# EAGLE schematic eclaire XL new (EAGLE 7.2.0)

## Sheet 1 of 16: FPGACore
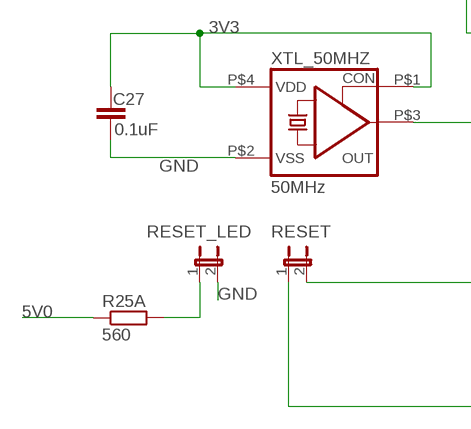
[diagram p0: schematic, sheet 1, part 1 of 2]
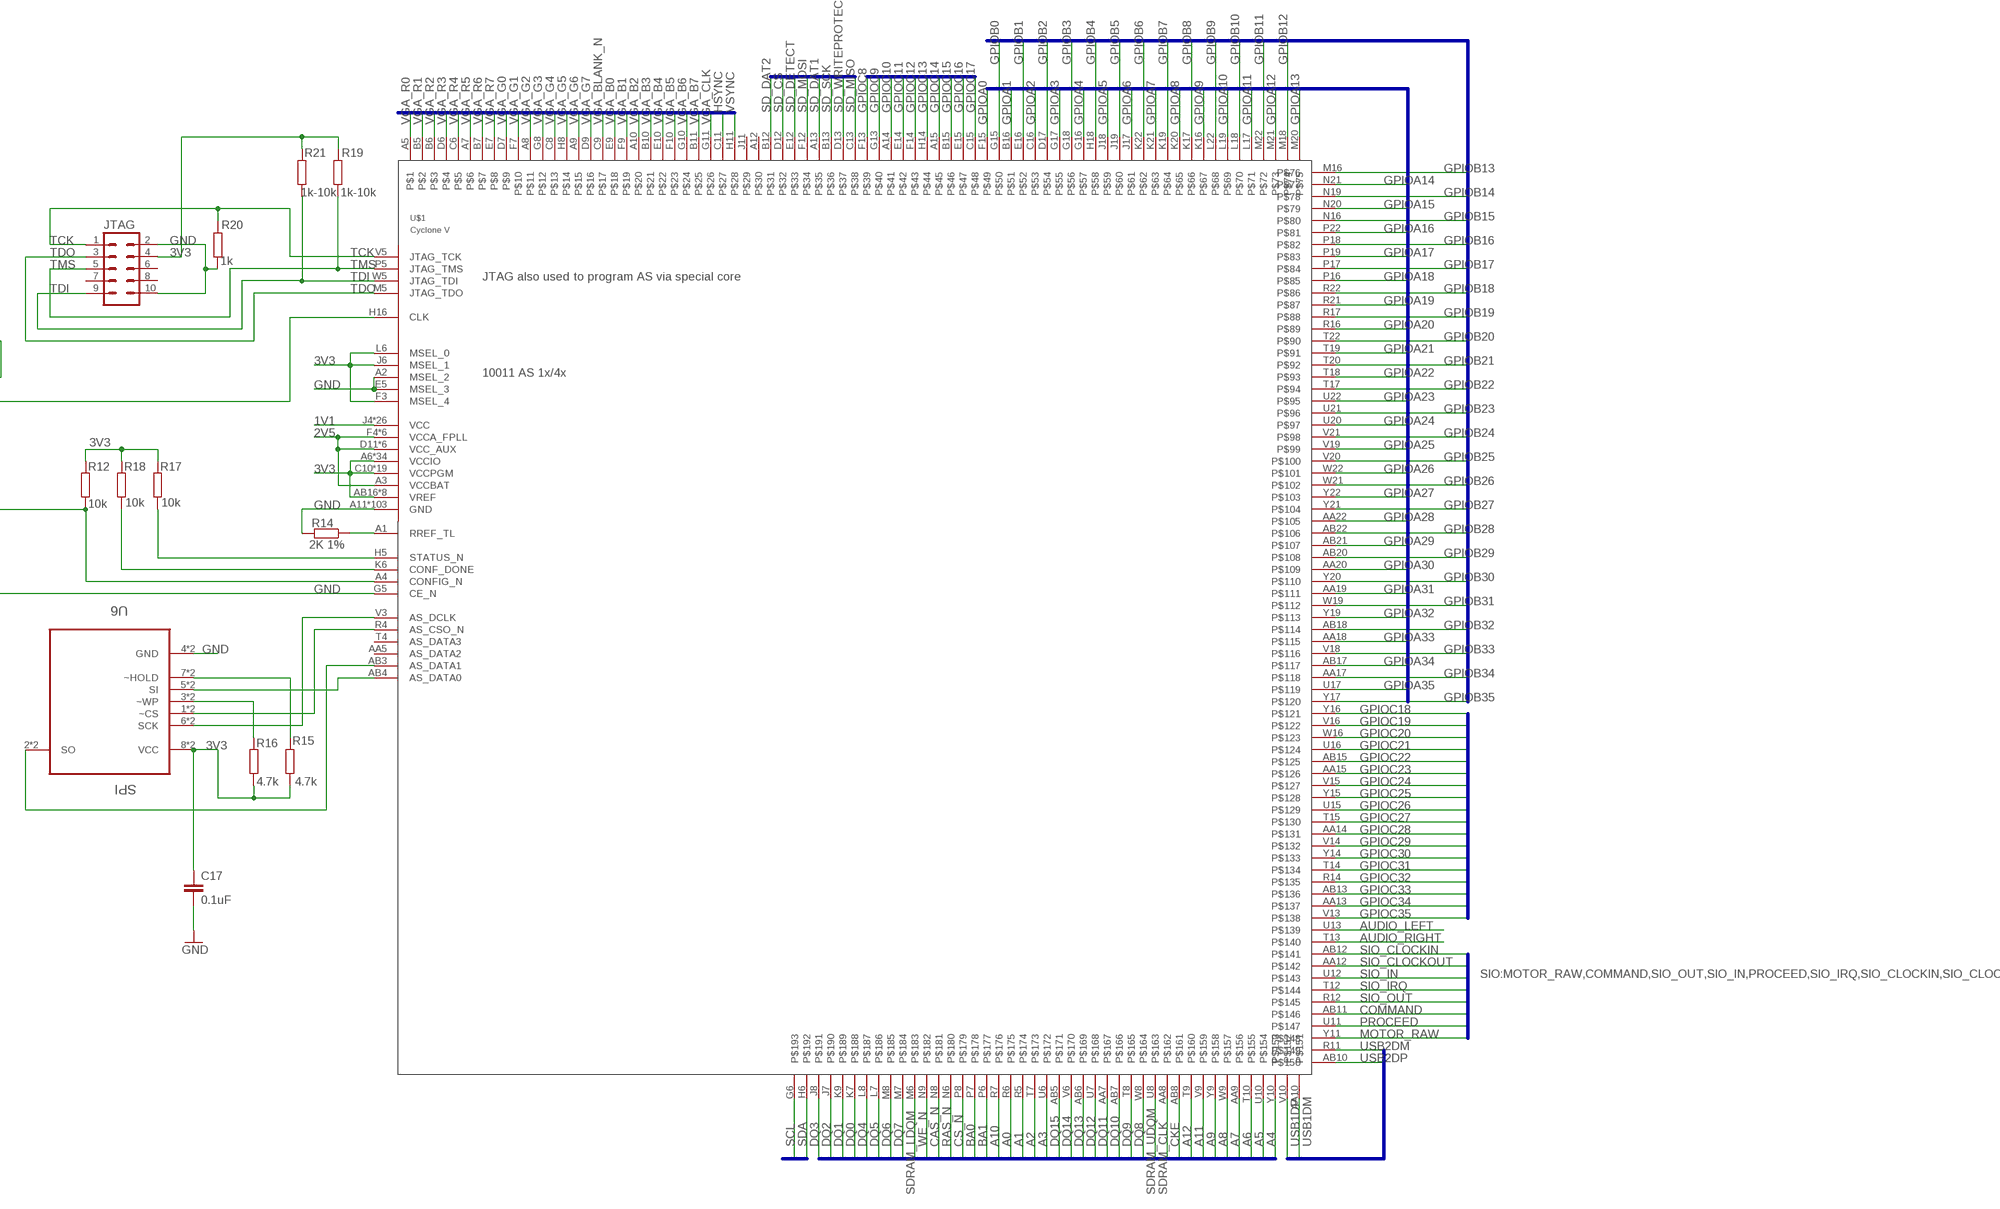
[diagram p1: schematic, sheet 1, part 2 of 2]

### Parts
C17  0.1uF  C-EUC0805  [C0805]
C27  0.1uF  C-EUC0805  [C0805]
JTAG  ML10  [ML10]
R12  10k  R-EU_M0805  [M0805]
R14  2K 1%  R-EU_M0805  [M0805]
R15  4.7k  R-EU_M0805  [M0805]
R16  4.7k  R-EU_M0805  [M0805]
R17  10k  R-EU_M0805  [M0805]
R18  10k  R-EU_M0805  [M0805]
R19  1k-10k  R-EU_M0805  [M0805]
R20  1k  R-EU_M0805  [M0805]
R21  1k-10k  R-EU_M0805  [M0805]
R25A  560  R-EU_M0805  [M0805]
RESET  RESET  JP1E  [JP1]
RESET_LED  RESET  JP1E  [JP1]
SPI  U6  EPCSBOTH  [EPCS_BOTH]
U$1  U7  CYCLONEVFPGA484SMALLPINS  [CYCLONEVF484V2]
XTL_50MHZ  50MHz  CRYSTAL_RES-SG636  [SG-636]

### Nets
1V1: U$1.J4(VCC) U$1.J10(VCC) U$1.J12(VCC) U$1.J14(VCC) U$1.J16(VCC) U$1.K3(VCC) U$1.K5(VCC) U$1.K11(VCC) U$1.K13(VCC) U$1.K15(VCC) U$1.L4(VCC) U$1.L10(VCC) U$1.L12(VCC) U$1.L14(VCC) U$1.L16(VCC) U$1.M11(VCC) U$1.M13(VCC) U$1.M15(VCC) U$1.N4(VCC) U$1.N10(VCC) U$1.N12(VCC) U$1.N14(VCC) U$1.P3(VCC) U$1.P11(VCC) U$1.P13(VCC) U$1.P15(VCC) ; also sheet 2,9
2V5: U$1.A3(VCCBAT) U$1.D11(VCC_AUX) U$1.D18(VCC_AUX) U$1.E6(VCC_AUX) U$1.F4(VCCA_FPLL) U$1.H19(VCCA_FPLL) U$1.M3(VCCA_FPLL) U$1.T3(VCCA_FPLL) U$1.T5(VCCA_FPLL) U$1.U18(VCCA_FPLL) U$1.W7(VCC_AUX) U$1.W13(VCC_AUX) U$1.W18(VCC_AUX) ; also sheet 2,9
3V3: C17.1 C27.1 JTAG.4 R12.2 R15.1 R16.1 R17.2 R18.2 R19.2 R21.2 SPI.8(VCC) SPI.L$2(VCC) U$1.A6(VCCIO) U$1.A16(VCCIO) U$1.AA16(VCCIO) U$1.AA21(VCCIO) U$1.AB16(VREF) U$1.B8(VREF) U$1.B19(VCCIO) U$1.C7(VCCIO) U$1.C10(VCCPGM) U$1.C12(VCCIO) U$1.C14(VREF) U$1.C22(VCCIO) U$1.D4(VCCIO) U$1.D8(VCCPGM) U$1.D14(VCCPGM) U$1.D15(VCCIO) U$1.D16(VCCPGM) U$1.E1(VCCPGM) U$1.E8(VCCIO) U$1.E11(VCCPGM) U$1.E18(VCCIO) U$1.F3(MSEL_4) U$1.F8(VCCPGM) U$1.F11(VCCIO) U$1.F21(VCCIO) U$1.G7(VCCIO) U$1.G14(VCCIO) U$1.H17(VCCIO) U$1.J1(VCCIO) U$1.J2(VCCPGM) U$1.J6(MSEL_1) U$1.K18(VCCIO) U$1.L6(MSEL_0) U$1.L20(VREF) U$1.M17(VCCPGM) U$1.M19(VCCIO) U$1.N18(VCCPGM) U$1.P20(VCCIO) U$1.P21(VCCPGM) U$1.R1(VCCIO) U$1.R2(VCCPGM) U$1.R8(VCCIO) U$1.R18(VCCIO) U$1.R19(VCCPGM) U$1.R20(VREF) U$1.T6(VCCIO) U$1.T11(VCCIO) U$1.U14(VCCIO) U$1.U19(VCCIO) U$1.V8(VCCPGM) U$1.W1(VREF) U$1.W6(VCCPGM) U$1.W10(VCCIO) U$1.W11(VCCPGM) U$1.W12(VCCPGM) U$1.W14(VCCPGM) U$1.W15(VCCIO) U$1.W17(VCCPGM) U$1.W20(VCCIO) U$1.Y4(VCCIO) U$1.Y7(VREF) U$1.Y8(VCCIO) U$1.Y12(VREF) U$1.Y13(VCCIO) XTL_50MHZ.P$1(CON) XTL_50MHZ.P$4(VDD) ; also sheet 2,3,5,6,8,9,10,11,15,16
5V0: R25A.1 ; also sheet 3,5,7,9,13,14,15
A0: U$1.R6 ; also sheet 6
A1: U$1.R5 ; also sheet 6
A2: U$1.T7 ; also sheet 6
A3: U$1.U6 ; also sheet 6
A4: U$1.Y10 ; also sheet 6
A5: U$1.U10 ; also sheet 6
A6: U$1.T10 ; also sheet 6
A7: U$1.AA9 ; also sheet 6
A8: U$1.W9 ; also sheet 6
A9: U$1.Y9 ; also sheet 6
A10: U$1.R7 ; also sheet 6
A11: U$1.V9 ; also sheet 6
A12: U$1.T9 ; also sheet 6
AUDIO_LEFT: U$1.U13 ; also sheet 4
AUDIO_RIGHT: U$1.T13 ; also sheet 4
BA0: U$1.P7 ; also sheet 6
BA1: U$1.P6 ; also sheet 6
CAS_N: U$1.N8 ; also sheet 6
CKE: U$1.AB8 ; also sheet 6
COMMAND: U$1.AB11 ; also sheet 13
CONF_DONE: R18.1 U$1.K6(CONF_DONE)
CONFIG_N: R12.1 RESET.2 U$1.A4(CONFIG_N)
CS_N: U$1.P8 ; also sheet 6
DQ0: U$1.K7 ; also sheet 6
DQ1: U$1.K9 ; also sheet 6
DQ2: U$1.J7 ; also sheet 6
DQ3: U$1.J8 ; also sheet 6
DQ4: U$1.L8 ; also sheet 6
DQ5: U$1.L7 ; also sheet 6
DQ6: U$1.M8 ; also sheet 6
DQ7: U$1.M7 ; also sheet 6
DQ8: U$1.W8 ; also sheet 6
DQ9: U$1.T8 ; also sheet 6
DQ10: U$1.AB7 ; also sheet 6
DQ11: U$1.AA7 ; also sheet 6
DQ12: U$1.U7 ; also sheet 6
DQ13: U$1.AB6 ; also sheet 6
DQ14: U$1.V6 ; also sheet 6
DQ15: U$1.AB5 ; also sheet 6
GND: C17.2 C27.2 JTAG.2 JTAG.10 R14.2 R20.2 RESET.1 RESET_LED.2 SPI.4(GND) SPI.L$10(GND) U$1.A2(MSEL_2) U$1.A11(GND) U$1.A21(GND) U$1.AA3(GND) U$1.AA4(GND) U$1.AA6(GND) U$1.AA11(GND) U$1.AB1(GND) U$1.AB2(GND) U$1.AB9(GND) U$1.AB14(GND) U$1.AB19(GND) U$1.B1(GND) U$1.B2(GND) U$1.B9(GND) U$1.B14(GND) U$1.C3(GND) U$1.C4(GND) U$1.C5(GND) U$1.C17(GND) U$1.D1(GND) U$1.D2(GND) U$1.D5(GND) U$1.D10(GND) U$1.D20(GND) U$1.E3(GND) U$1.E4(GND) U$1.E5(MSEL_3) U$1.E13(GND) U$1.F1(GND) U$1.F2(GND) U$1.F5(GND) U$1.F6(GND) U$1.F16(GND) U$1.F17(GND) U$1.G3(GND) U$1.G4(GND) U$1.G5(CE_N) U$1.G9(GND) U$1.G19(GND) U$1.H1(GND) U$1.H2(GND) U$1.H3(GND) U$1.H4(GND) U$1.H7(GND) U$1.H12(GND) U$1.H15(GND) U$1.H22(GND) U$1.J3(GND) U$1.J5(GND) U$1.J15(GND) U$1.J20(GND) U$1.K1(GND) U$1.K2(GND) U$1.K4(GND) U$1.K8(GND) U$1.K10(GND) U$1.K12(GND) U$1.K14(GND) U$1.L3(GND) U$1.L5(GND) U$1.L11(GND) U$1.L13(GND) U$1.L15(GND) U$1.L21(GND) U$1.M1(GND) U$1.M2(GND) U$1.M4(GND) U$1.M10(GND) U$1.M12(GND) U$1.M14(GND) U$1.N3(GND) U$1.N5(GND) U$1.N7(GND) U$1.N11(GND) U$1.N13(GND) U$1.N15(GND) U$1.N17(GND) U$1.N22(GND) U$1.P1(GND) U$1.P2(GND) U$1.P4(GND) U$1.P10(GND) U$1.R3(GND) U$1.R13(GND) U$1.T1(GND) U$1.T2(GND) U$1.T16(GND) U$1.T21(GND) U$1.U3(GND) U$1.U4(GND) U$1.U5(GND) U$1.U9(GND) U$1.V1(GND) U$1.V2(GND) U$1.V4(GND) U$1.V7(GND) U$1.V12(GND) U$1.V17(GND) U$1.V22(GND) U$1.W3(GND) U$1.W4(GND) U$1.Y1(GND) U$1.Y2(GND) U$1.Y5(GND) U$1.Y18(GND) XTL_50MHZ.P$2(VSS) ; also sheet 2,3,4,5,6,7,8,9,10,11,12,13,14,15,16
GPIOA0: U$1.F15 ; also sheet 5
GPIOA1: U$1.B16 ; also sheet 5
GPIOA2: U$1.C16 ; also sheet 5
GPIOA3: U$1.G17 ; also sheet 5
GPIOA4: U$1.G16 ; also sheet 5
GPIOA5: U$1.J18 ; also sheet 5
GPIOA6: U$1.J17 ; also sheet 5
GPIOA7: U$1.K21 ; also sheet 5
GPIOA8: U$1.K20 ; also sheet 5
GPIOA9: U$1.K16 ; also sheet 5
GPIOA10: U$1.L19 ; also sheet 5
GPIOA11: U$1.L17 ; also sheet 5
GPIOA12: U$1.M21 ; also sheet 5
GPIOA13: U$1.M20 ; also sheet 5
GPIOA14: U$1.N21 ; also sheet 5
GPIOA15: U$1.N20 ; also sheet 5
GPIOA16: U$1.P22 ; also sheet 5
GPIOA17: U$1.P19 ; also sheet 5
GPIOA18: U$1.P16 ; also sheet 5
GPIOA19: U$1.R21 ; also sheet 5
GPIOA20: U$1.R16 ; also sheet 5
GPIOA21: U$1.T19 ; also sheet 5
GPIOA22: U$1.T18 ; also sheet 5
GPIOA23: U$1.U22 ; also sheet 5
GPIOA24: U$1.U20 ; also sheet 5
GPIOA25: U$1.V19 ; also sheet 5
GPIOA26: U$1.W22 ; also sheet 5
GPIOA27: U$1.Y22 ; also sheet 5
GPIOA28: U$1.AA22 ; also sheet 5
GPIOA29: U$1.AB21 ; also sheet 5
GPIOA30: U$1.AA20 ; also sheet 5
GPIOA31: U$1.AA19 ; also sheet 5
GPIOA32: U$1.Y19 ; also sheet 5
GPIOA33: U$1.AA18 ; also sheet 5
GPIOA34: U$1.AB17 ; also sheet 5
GPIOA35: U$1.U17 ; also sheet 5
GPIOB0: U$1.G15 ; also sheet 15
GPIOB1: U$1.E16 ; also sheet 15
GPIOB2: U$1.D17 ; also sheet 15
GPIOB3: U$1.G18 ; also sheet 15
GPIOB4: U$1.H18 ; also sheet 15
GPIOB5: U$1.J19 ; also sheet 15
GPIOB6: U$1.K22 ; also sheet 15
GPIOB7: U$1.K19 ; also sheet 15
GPIOB8: U$1.K17 ; also sheet 5
GPIOB9: U$1.L22 ; also sheet 5
GPIOB10: U$1.L18 ; also sheet 5
GPIOB11: U$1.M22 ; also sheet 5
GPIOB12: U$1.M18 ; also sheet 5
GPIOB13: U$1.M16 ; also sheet 5
GPIOB14: U$1.N19 ; also sheet 5
GPIOB15: U$1.N16 ; also sheet 5
GPIOB16: U$1.P18 ; also sheet 14
GPIOB17: U$1.P17 ; also sheet 14
GPIOB18: U$1.R22 ; also sheet 14
GPIOB19: U$1.R17 ; also sheet 14
GPIOB20: U$1.T22 ; also sheet 14
GPIOB21: U$1.T20 ; also sheet 14
GPIOB22: U$1.T17 ; also sheet 14
GPIOB23: U$1.U21 ; also sheet 14
GPIOB24: U$1.V21 ; also sheet 14
GPIOB25: U$1.V20 ; also sheet 14
GPIOB26: U$1.W21 ; also sheet 14
GPIOB27: U$1.Y21 ; also sheet 14
GPIOB28: U$1.AB22 ; also sheet 14
GPIOB29: U$1.AB20 ; also sheet 14
GPIOB30: U$1.Y20 ; also sheet 14
GPIOB31: U$1.W19 ; also sheet 14
GPIOB32: U$1.AB18 ; also sheet 14
GPIOB33: U$1.V18 ; also sheet 14
GPIOB34: U$1.AA17 ; also sheet 14
GPIOB35: U$1.Y17 ; also sheet 14
GPIOC8: U$1.F13 ; also sheet 15
GPIOC9: U$1.G13 ; also sheet 15
GPIOC10: U$1.A14 ; also sheet 15
GPIOC11: U$1.E14 ; also sheet 15
GPIOC12: U$1.F14 ; also sheet 15
GPIOC13: U$1.H14 ; also sheet 15
GPIOC14: U$1.A15 ; also sheet 15
GPIOC15: U$1.B15 ; also sheet 15
GPIOC16: U$1.E15 ; also sheet 5
GPIOC17: U$1.C15 ; also sheet 5
GPIOC18: U$1.Y16 ; also sheet 5
GPIOC19: U$1.V16 ; also sheet 5
GPIOC20: U$1.W16 ; also sheet 14
GPIOC21: U$1.U16 ; also sheet 14
GPIOC22: U$1.AB15 ; also sheet 14
GPIOC23: U$1.AA15 ; also sheet 14
GPIOC24: U$1.V15 ; also sheet 14
GPIOC25: U$1.Y15 ; also sheet 14
GPIOC26: U$1.U15 ; also sheet 14
GPIOC27: U$1.T15 ; also sheet 14
GPIOC28: U$1.AA14 ; also sheet 14
GPIOC29: U$1.V14 ; also sheet 14
GPIOC30: U$1.Y14 ; also sheet 14
GPIOC31: U$1.T14 ; also sheet 14
GPIOC32: U$1.R14 ; also sheet 14
GPIOC33: U$1.AB13 ; also sheet 14
GPIOC34: U$1.AA13 ; also sheet 14
GPIOC35: U$1.V13 ; also sheet 14
HSYNC: U$1.C11 ; also sheet 3
MOTOR_RAW: U$1.Y11 ; also sheet 13
N$6: SPI.6(SCK) SPI.L$16(SCK) U$1.V3(AS_DCLK)
N$7: SPI.1(~CS) SPI.L$7(~CS) U$1.R4(AS_CSO_N)
N$8: SPI.2(SO) SPI.L$8(SO) U$1.AB3(AS_DATA1)
N$9: SPI.5(SI) SPI.L$15(SI) U$1.AB4(AS_DATA0)
N$10: R16.2 SPI.3(~WP) SPI.L$9(~WP)
N$11: R15.2 SPI.7(~HOLD) SPI.L$1(~HOLD)
N$12: U$1.H16(CLK) XTL_50MHZ.P$3(OUT)
N$81: R25A.2 RESET_LED.1
PROCEED: U$1.U11 ; also sheet 13
RAS_N: U$1.N6 ; also sheet 6
RREF_TL: R14.1 U$1.A1(RREF_TL)
SCL: U$1.G6 ; also sheet 11
SD_CS: U$1.D12 ; also sheet 10
SD_DAT1: U$1.A13 ; also sheet 10
SD_DAT2: U$1.B12 ; also sheet 10
SD_DETECT: U$1.E12 ; also sheet 10
SD_MISO: U$1.C13 ; also sheet 10
SD_MOSI: U$1.F12 ; also sheet 10
SD_SCK: U$1.B13 ; also sheet 10
SD_WRITEPROTECT: U$1.D13 ; also sheet 10
SDA: U$1.H6 ; also sheet 11
SDRAM_CLK: U$1.AA8 ; also sheet 6
SDRAM_LDQM: U$1.M6 ; also sheet 6
SDRAM_UDQM: U$1.U8 ; also sheet 6
SIO_CLOCKIN: U$1.AB12 ; also sheet 13
SIO_CLOCKOUT: U$1.AA12 ; also sheet 13
SIO_IN: U$1.U12 ; also sheet 13
SIO_IRQ: U$1.T12 ; also sheet 13
SIO_OUT: U$1.R12 ; also sheet 13
STATUS_N: R17.1 U$1.H5(STATUS_N)
TCK: JTAG.1 R20.1 U$1.V5(JTAG_TCK)
TDI: JTAG.9 R21.1 U$1.W5(JTAG_TDI)
TDO: JTAG.3 U$1.M5(JTAG_TDO)
TMS: JTAG.5 R19.1 U$1.P5(JTAG_TMS)
USB1DM: U$1.AA10 ; also sheet 7
USB1DP: U$1.V10 ; also sheet 7
USB2DM: U$1.R11 ; also sheet 7
USB2DP: U$1.AB10 ; also sheet 7
VGA_B0: U$1.E9 ; also sheet 3
VGA_B1: U$1.F9 ; also sheet 3
VGA_B2: U$1.A10 ; also sheet 3
VGA_B3: U$1.B10 ; also sheet 3
VGA_B4: U$1.E10 ; also sheet 3
VGA_B5: U$1.F10 ; also sheet 3
VGA_B6: U$1.G10 ; also sheet 3
VGA_B7: U$1.B11 ; also sheet 3
VGA_BLANK_N: U$1.C9 ; also sheet 3
VGA_CLK: U$1.G11 ; also sheet 3
VGA_G0: U$1.D7 ; also sheet 3
VGA_G1: U$1.F7 ; also sheet 3
VGA_G2: U$1.A8 ; also sheet 3
VGA_G3: U$1.G8 ; also sheet 3
VGA_G4: U$1.C8 ; also sheet 3
VGA_G5: U$1.H8 ; also sheet 3
VGA_G6: U$1.A9 ; also sheet 3
VGA_G7: U$1.D9 ; also sheet 3
VGA_R0: U$1.A5 ; also sheet 3
VGA_R1: U$1.B5 ; also sheet 3
VGA_R2: U$1.B6 ; also sheet 3
VGA_R3: U$1.D6 ; also sheet 3
VGA_R4: U$1.C6 ; also sheet 3
VGA_R5: U$1.A7 ; also sheet 3
VGA_R6: U$1.B7 ; also sheet 3
VGA_R7: U$1.E7 ; also sheet 3
VSYNC: U$1.H11 ; also sheet 3
WE_N: U$1.N9 ; also sheet 6
Unconnected: JTAG.6 JTAG.7 JTAG.8 U$1.A12 U$1.AA5(AS_DATA2) U$1.J11 U$1.T4(AS_DATA3)

### Buses
SDRAM:A[0..12],DQ[0..15],CS_N,RAS_N,CAS_N,WE_N,SDRAM_CLK,CKE,SDRAM_UDQM,SDRAM_LDQM,BA[0..1]
USB1DP,USB1DM,USB2DP,USB2DM
VGADAC:VGA_R[0..7],VGA_G[0..7],VGA_B[0..7],VGA_CLK,VGA_BLANK_N,HSYNC,VSYNC
SD_DETECT,SD_WRITEPROTECT,SD_CS,SD_MISO,SD_MOSI,SD_SCK,SD_DAT1,SD_DAT2
GPIOC[0..35]
GPIOA[0..35]
GPIOB[0..35]
ADC:SCL,SDA
SIO:MOTOR_RAW,COMMAND,SIO_OUT,SIO_IN,PROCEED,SIO_IRQ,SIO_CLOCKIN,SIO_CLOCKOUT

### Notes on the sheet
- JTAG also used to program AS via special core
- 10011 AS 1x/4x

## Sheet 2 of 16: FPGA decoupling
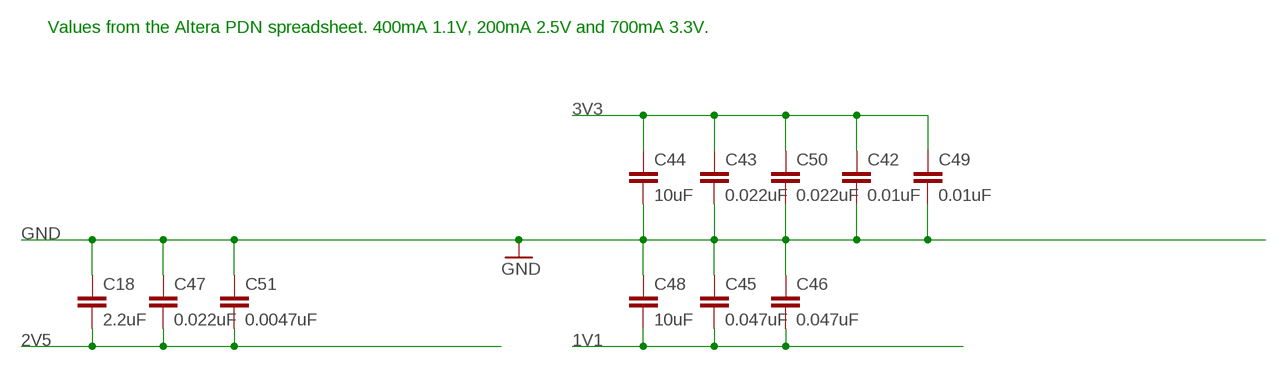
[diagram p2: schematic, sheet 2]

### Parts
C18  2.2uF  C-EUC0805  [C0805]
C42  0.01uF  C-EUC0805  [C0805]
C43  0.022uF  C-EUC0805  [C0805]
C44  10uF  C-EUC0805  [C0805]
C45  0.047uF  C-EUC0805  [C0805]
C46  0.047uF  C-EUC0805  [C0805]
C47  0.022uF  C-EUC0805  [C0805]
C48  10uF  C-EUC0805  [C0805]
C49  0.01uF  C-EUC0805  [C0805]
C50  0.022uF  C-EUC0805  [C0805]
C51  0.0047uF  C-EUC0805  [C0805]

### Nets
1V1: C45.2 C46.2 C48.2 ; also sheet 1,9
2V5: C18.2 C47.2 C51.2 ; also sheet 1,9
3V3: C42.1 C43.1 C44.1 C49.1 C50.1 ; also sheet 1,3,5,6,8,9,10,11,15,16
GND: C18.1 C42.2 C43.2 C44.2 C45.1 C46.1 C47.1 C48.1 C49.2 C50.2 C51.1 ; also sheet 1,3,4,5,6,7,8,9,10,11,12,13,14,15,16

### Notes on the sheet
- Values from the Altera PDN spreadsheet. 400mA 1.1V, 200mA 2.5V and 700mA 3.3V.

## Sheet 3 of 16: Video
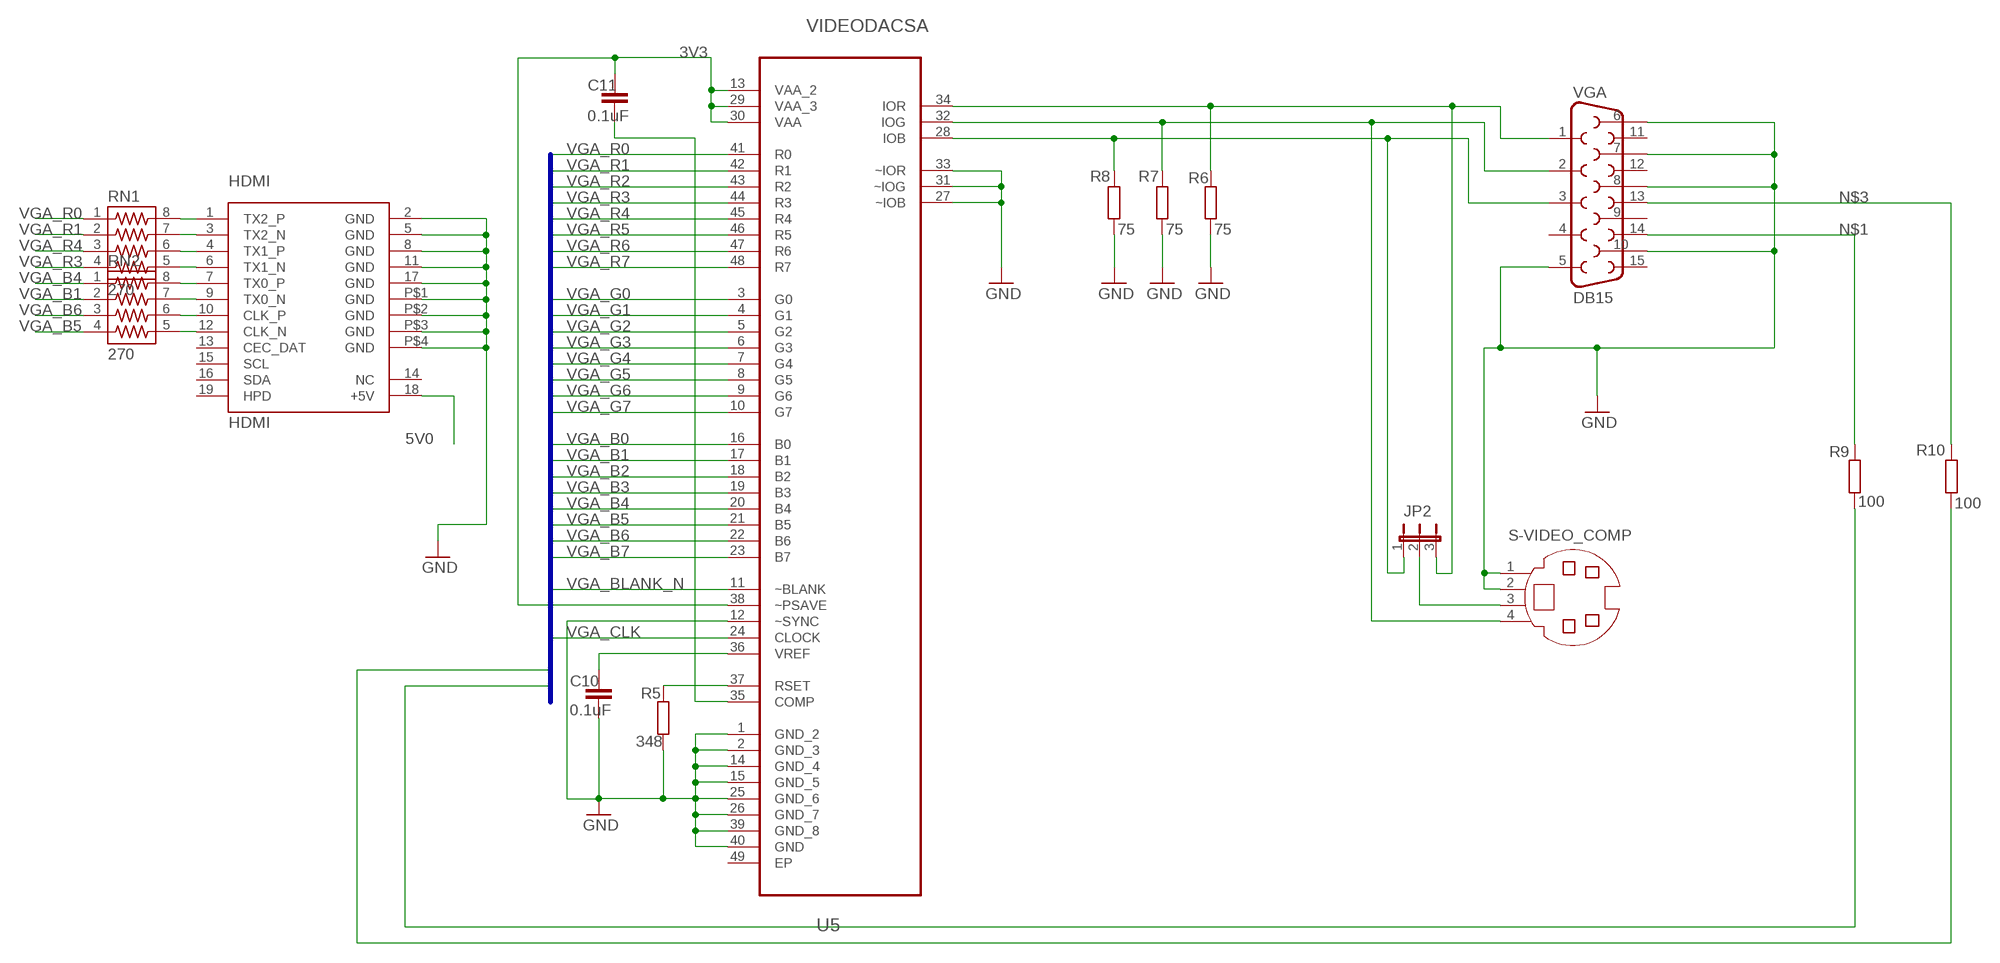
[diagram p3: schematic, sheet 3]

### Parts
C10  0.1uF  C-EUC0805  [C0805]
C11  0.1uF  C-EUC0805  [C0805]
HDMI  HDMI  [HDMI]
JP2  JP2E  [JP2]
R5  348  R-EU_M0805  [M0805]
R6  75  R-EU_M0805  [M0805]
R7  75  R-EU_M0805  [M0805]
R8  75  R-EU_M0805  [M0805]
R9  100  R-EU_R0805  [R0805]
R10  100  R-EU_R0805  [R0805]
RN1  270  742-8742_3  [743-8]
RN2  270  742-8742_3  [743-8]
S-VIDEO_COMP  MD04SS  [MDIN04SS]
VGA  DB15  [DB15]
VIDEODACSA  U5  ADV7125BCPZ170TQFP-48  [QFP50P900X900X120-49N]

### Nets
3V3: C11.1 VIDEODACSA.13(VAA_2) VIDEODACSA.29(VAA_3) VIDEODACSA.30(VAA) VIDEODACSA.38(~PSAVE) ; also sheet 1,2,5,6,8,9,10,11,15,16
5V0: HDMI.18(+5V) ; also sheet 1,5,7,9,13,14,15
GND: C10.2 HDMI.2(GND) HDMI.5(GND) HDMI.8(GND) HDMI.11(GND) HDMI.17(GND) HDMI.P$1(GND) HDMI.P$2(GND) HDMI.P$3(GND) HDMI.P$4(GND) R5.1 R6.1 R7.1 R8.1 S-VIDEO_COMP.1 S-VIDEO_COMP.2 VGA.5 VGA.6 VGA.7 VGA.8 VGA.10 VIDEODACSA.1(GND_2) VIDEODACSA.2(GND_3) VIDEODACSA.12(~SYNC) VIDEODACSA.14(GND_4) VIDEODACSA.15(GND_5) VIDEODACSA.25(GND_6) VIDEODACSA.26(GND_7) VIDEODACSA.27(~IOB) VIDEODACSA.31(~IOG) VIDEODACSA.33(~IOR) VIDEODACSA.39(GND_8) VIDEODACSA.40(GND) ; also sheet 1,2,4,5,6,7,8,9,10,11,12,13,14,15,16
HSYNC: R10.1 ; also sheet 1
N$1: R9.2 VGA.14
N$3: R10.2 VGA.13
N$13: JP2.3 R6.2 VGA.1 VIDEODACSA.34(IOR)
N$14: R7.2 S-VIDEO_COMP.4 VGA.2 VIDEODACSA.32(IOG)
N$16: C10.1 VIDEODACSA.36(VREF)
N$17: R5.2 VIDEODACSA.37(RSET)
N$18: C11.2 VIDEODACSA.35(COMP)
N$134: HDMI.1(TX2_P) RN1.8
N$143: JP2.1 R8.2 VGA.3 VIDEODACSA.28(IOB)
N$144: HDMI.3(TX2_N) RN1.7
N$146: HDMI.4(TX1_P) RN1.6
N$147: HDMI.6(TX1_N) RN1.5
N$148: HDMI.7(TX0_P) RN2.8
N$149: HDMI.9(TX0_N) RN2.7
N$150: HDMI.10(CLK_P) RN2.6
N$151: HDMI.12(CLK_N) RN2.5
N$152: JP2.2 S-VIDEO_COMP.3
VGA_B0: VIDEODACSA.16(B0) ; also sheet 1
VGA_B1: RN2.2 VIDEODACSA.17(B1) ; also sheet 1
VGA_B2: VIDEODACSA.18(B2) ; also sheet 1
VGA_B3: VIDEODACSA.19(B3) ; also sheet 1
VGA_B4: RN2.1 VIDEODACSA.20(B4) ; also sheet 1
VGA_B5: RN2.4 VIDEODACSA.21(B5) ; also sheet 1
VGA_B6: RN2.3 VIDEODACSA.22(B6) ; also sheet 1
VGA_B7: VIDEODACSA.23(B7) ; also sheet 1
VGA_BLANK_N: VIDEODACSA.11(~BLANK) ; also sheet 1
VGA_CLK: VIDEODACSA.24(CLOCK) ; also sheet 1
VGA_G0: VIDEODACSA.3(G0) ; also sheet 1
VGA_G1: VIDEODACSA.4(G1) ; also sheet 1
VGA_G2: VIDEODACSA.5(G2) ; also sheet 1
VGA_G3: VIDEODACSA.6(G3) ; also sheet 1
VGA_G4: VIDEODACSA.7(G4) ; also sheet 1
VGA_G5: VIDEODACSA.8(G5) ; also sheet 1
VGA_G6: VIDEODACSA.9(G6) ; also sheet 1
VGA_G7: VIDEODACSA.10(G7) ; also sheet 1
VGA_R0: RN1.1 VIDEODACSA.41(R0) ; also sheet 1
VGA_R1: RN1.2 VIDEODACSA.42(R1) ; also sheet 1
VGA_R2: VIDEODACSA.43(R2) ; also sheet 1
VGA_R3: RN1.4 VIDEODACSA.44(R3) ; also sheet 1
VGA_R4: RN1.3 VIDEODACSA.45(R4) ; also sheet 1
VGA_R5: VIDEODACSA.46(R5) ; also sheet 1
VGA_R6: VIDEODACSA.47(R6) ; also sheet 1
VGA_R7: VIDEODACSA.48(R7) ; also sheet 1
VSYNC: R9.1 ; also sheet 1
Unconnected: HDMI.13(CEC_DAT) HDMI.14(NC) HDMI.15(SCL) HDMI.16(SDA) HDMI.19(HPD) VGA.4 VGA.9 VGA.11 VGA.12 VGA.15 VIDEODACSA.49(EP)

### Buses
VGADAC:VGA_R[0..7],VGA_G[0..7],VGA_B[0..7],VGA_CLK,VGA_BLANK_N,HSYNC,VSYNC

## Sheet 4 of 16: Audio and filter
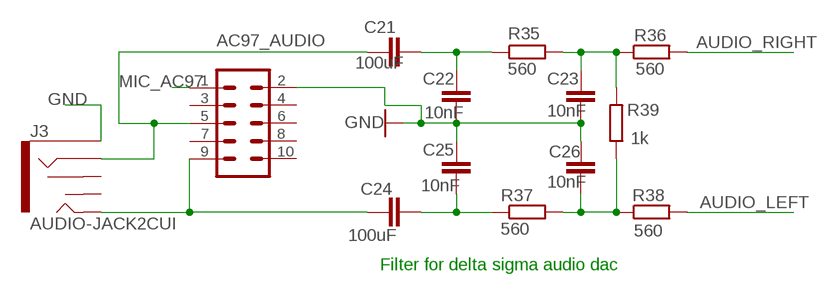
[diagram p4: schematic, sheet 4]

### Parts
AC97_AUDIO  ML10  [ML10]
C21  100uF  C-EUC1206  [C1206]
C22  10nF  C-EUC0805  [C0805]
C23  10nF  C-EUC0805  [C0805]
C24  100uF  C-EUC1206  [C1206]
C25  10nF  C-EUC0805  [C0805]
C26  10nF  C-EUC0805  [C0805]
J3  AUDIO-JACK2CUI  [AUDIO-JACK-CUI-353X]
R35  560  R-EU_M0805  [M0805]
R36  560  R-EU_M0805  [M0805]
R37  560  R-EU_M0805  [M0805]
R38  560  R-EU_M0805  [M0805]
R39  1k  R-EU_M0805  [M0805]

### Nets
AUDIO_LEFT: R38.2 ; also sheet 1
AUDIO_RIGHT: R36.2 ; also sheet 1
GND: AC97_AUDIO.2 C22.2 C23.2 C25.1 C26.1 J3.P$1(SLEEVE) ; also sheet 1,2,3,5,6,7,8,9,10,11,12,13,14,15,16
MIC_AC97: AC97_AUDIO.1 ; also sheet 11
N$5: C21.2 C22.1 R35.1
N$27: C23.1 R35.2 R36.1 R39.2
N$28: C26.2 R37.2 R38.1 R39.1
N$138: AC97_AUDIO.9 C24.1 J3.P$2(TIP)
N$141: AC97_AUDIO.5 C21.1 J3.P$3(RING)
N$142: C24.2 C25.2 R37.1
Unconnected: AC97_AUDIO.3 AC97_AUDIO.4 AC97_AUDIO.6 AC97_AUDIO.7 AC97_AUDIO.8 AC97_AUDIO.10 J3.P$4(TSH) J3.P$5(RSH)

### Notes on the sheet
- Filter for delta sigma audio dac

## Sheet 5 of 16: GPIO
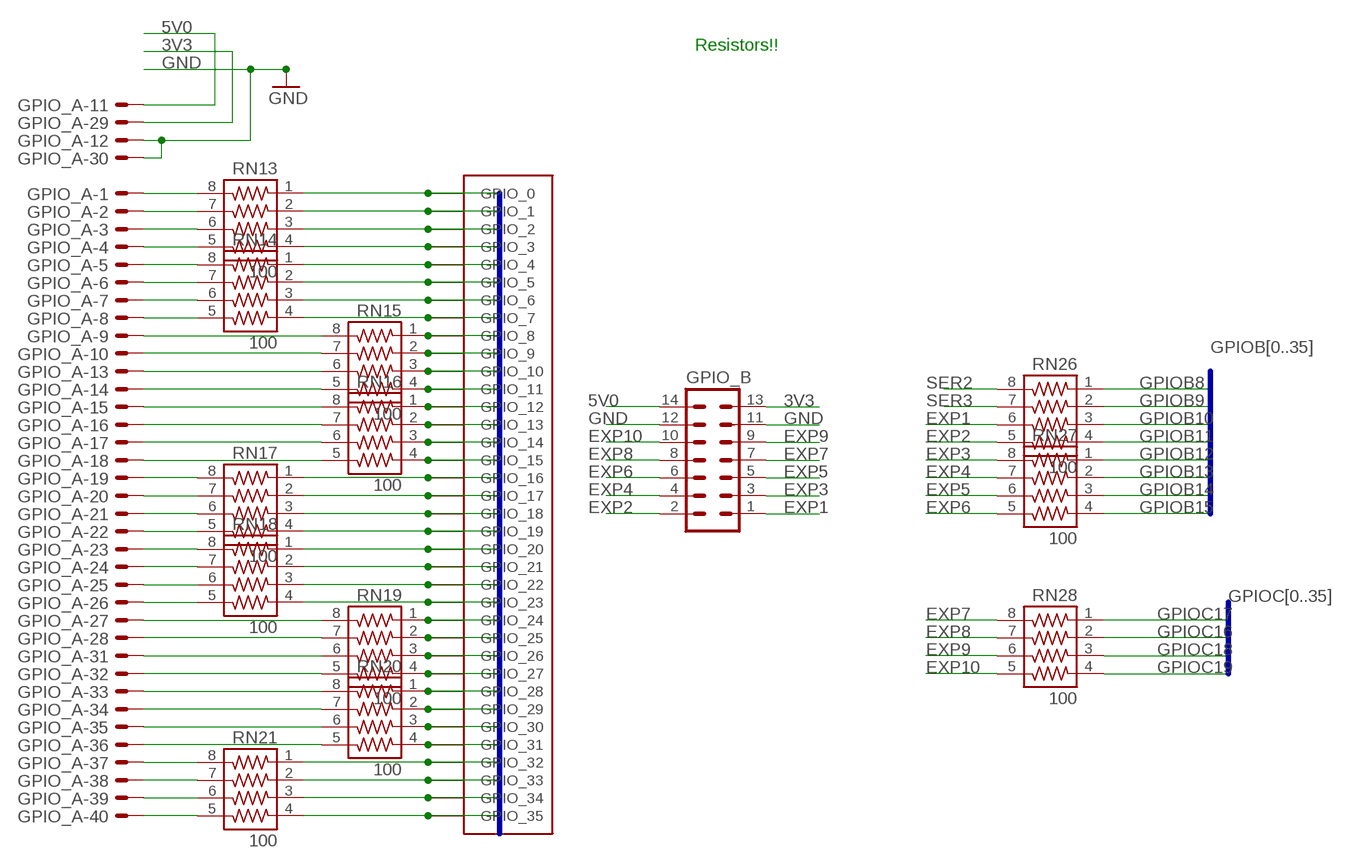
[diagram p5: schematic, sheet 5]

### Parts
GPIO_A  ML40E  [ML40]
GPIO_B  ML14  [ML14]
RN13  100  742-8742_3  [743-8]
RN14  100  742-8742_3  [743-8]
RN15  100  742-8742_3  [743-8]
RN16  100  742-8742_3  [743-8]
RN17  100  742-8742_3  [743-8]
RN18  100  742-8742_3  [743-8]
RN19  100  742-8742_3  [743-8]
RN20  100  742-8742_3  [743-8]
RN21  100  742-8742_3  [743-8]
RN26  100  742-8742_3  [743-8]
RN27  100  742-8742_3  [743-8]
RN28  100  742-8742_3  [743-8]
U$5  HDR_SMALL_36_DEV_LALIGNED  [HDR_141_36]

### Nets
3V3: GPIO_A.29 GPIO_B.13 ; also sheet 1,2,3,6,8,9,10,11,15,16
5V0: GPIO_A.11 GPIO_B.14 ; also sheet 1,3,7,9,13,14,15
EXP1: GPIO_B.1 RN26.6
EXP2: GPIO_B.2 RN26.5
EXP3: GPIO_B.3 RN27.8
EXP4: GPIO_B.4 RN27.7
EXP5: GPIO_B.5 RN27.6
EXP6: GPIO_B.6 RN27.5
EXP7: GPIO_B.7 RN28.8
EXP8: GPIO_B.8 RN28.7
EXP9: GPIO_B.9 RN28.6
EXP10: GPIO_B.10 RN28.5
GND: GPIO_A.12 GPIO_A.30 GPIO_B.11 GPIO_B.12 ; also sheet 1,2,3,4,6,7,8,9,10,11,12,13,14,15,16
GPIOA0: RN13.1 U$5.P$1(GPIO_0) ; also sheet 1
GPIOA1: RN13.2 U$5.P$2(GPIO_1) ; also sheet 1
GPIOA2: RN13.3 U$5.P$3(GPIO_2) ; also sheet 1
GPIOA3: RN13.4 U$5.P$4(GPIO_3) ; also sheet 1
GPIOA4: RN14.1 U$5.P$5(GPIO_4) ; also sheet 1
GPIOA5: RN14.2 U$5.P$6(GPIO_5) ; also sheet 1
GPIOA6: RN14.3 U$5.P$7(GPIO_6) ; also sheet 1
GPIOA7: RN14.4 U$5.P$8(GPIO_7) ; also sheet 1
GPIOA8: RN15.1 U$5.P$9(GPIO_8) ; also sheet 1
GPIOA9: RN15.2 U$5.P$10(GPIO_9) ; also sheet 1
GPIOA10: RN15.3 U$5.P$11(GPIO_10) ; also sheet 1
GPIOA11: RN15.4 U$5.P$12(GPIO_11) ; also sheet 1
GPIOA12: RN16.1 U$5.P$13(GPIO_12) ; also sheet 1
GPIOA13: RN16.2 U$5.P$14(GPIO_13) ; also sheet 1
GPIOA14: RN16.3 U$5.P$15(GPIO_14) ; also sheet 1
GPIOA15: RN16.4 U$5.P$16(GPIO_15) ; also sheet 1
GPIOA16: RN17.1 U$5.P$17(GPIO_16) ; also sheet 1
GPIOA17: RN17.2 U$5.P$18(GPIO_17) ; also sheet 1
GPIOA18: RN17.3 U$5.P$19(GPIO_18) ; also sheet 1
GPIOA19: RN17.4 U$5.P$20(GPIO_19) ; also sheet 1
GPIOA20: RN18.1 U$5.P$21(GPIO_20) ; also sheet 1
GPIOA21: RN18.2 U$5.P$22(GPIO_21) ; also sheet 1
GPIOA22: RN18.3 U$5.P$23(GPIO_22) ; also sheet 1
GPIOA23: RN18.4 U$5.P$24(GPIO_23) ; also sheet 1
GPIOA24: RN19.1 U$5.P$25(GPIO_24) ; also sheet 1
GPIOA25: RN19.2 U$5.P$26(GPIO_25) ; also sheet 1
GPIOA26: RN19.3 U$5.P$27(GPIO_26) ; also sheet 1
GPIOA27: RN19.4 U$5.P$28(GPIO_27) ; also sheet 1
GPIOA28: RN20.1 U$5.P$29(GPIO_28) ; also sheet 1
GPIOA29: RN20.2 U$5.P$30(GPIO_29) ; also sheet 1
GPIOA30: RN20.3 U$5.P$31(GPIO_30) ; also sheet 1
GPIOA31: RN20.4 U$5.P$32(GPIO_31) ; also sheet 1
GPIOA32: RN21.1 U$5.P$33(GPIO_32) ; also sheet 1
GPIOA33: RN21.2 U$5.P$34(GPIO_33) ; also sheet 1
GPIOA34: RN21.3 U$5.P$35(GPIO_34) ; also sheet 1
GPIOA35: RN21.4 U$5.P$36(GPIO_35) ; also sheet 1
GPIOB8: RN26.1 ; also sheet 1
GPIOB9: RN26.2 ; also sheet 1
GPIOB10: RN26.3 ; also sheet 1
GPIOB11: RN26.4 ; also sheet 1
GPIOB12: RN27.1 ; also sheet 1
GPIOB13: RN27.2 ; also sheet 1
GPIOB14: RN27.3 ; also sheet 1
GPIOB15: RN27.4 ; also sheet 1
GPIOC16: RN28.2 ; also sheet 1
GPIOC17: RN28.1 ; also sheet 1
GPIOC18: RN28.3 ; also sheet 1
GPIOC19: RN28.4 ; also sheet 1
N$22: GPIO_A.1 RN13.8
N$24: GPIO_A.2 RN13.7
N$29: GPIO_A.3 RN13.6
N$30: GPIO_A.4 RN13.5
N$31: GPIO_A.5 RN14.8
N$32: GPIO_A.6 RN14.7
N$33: GPIO_A.7 RN14.6
N$34: GPIO_A.8 RN14.5
N$35: GPIO_A.9 RN15.8
N$36: GPIO_A.10 RN15.7
N$37: GPIO_A.13 RN15.6
N$38: GPIO_A.14 RN15.5
N$39: GPIO_A.15 RN16.8
N$40: GPIO_A.17 RN16.6
N$41: GPIO_A.16 RN16.7
N$42: GPIO_A.18 RN16.5
N$43: GPIO_A.19 RN17.8
N$44: GPIO_A.20 RN17.7
N$45: GPIO_A.21 RN17.6
N$46: GPIO_A.22 RN17.5
N$47: GPIO_A.23 RN18.8
N$48: GPIO_A.25 RN18.6
N$49: GPIO_A.24 RN18.7
N$50: GPIO_A.26 RN18.5
N$51: GPIO_A.27 RN19.8
N$52: GPIO_A.28 RN19.7
N$53: GPIO_A.31 RN19.6
N$54: GPIO_A.32 RN19.5
N$55: GPIO_A.33 RN20.8
N$56: GPIO_A.34 RN20.7
N$57: GPIO_A.35 RN20.6
N$58: GPIO_A.36 RN20.5
N$59: GPIO_A.37 RN21.8
N$60: GPIO_A.38 RN21.7
N$61: GPIO_A.39 RN21.6
N$62: GPIO_A.40 RN21.5
SER2: RN26.8 ; also sheet 16
SER3: RN26.7 ; also sheet 16

### Buses
GPIOA[0..35]
GPIOB[0..35]
GPIOC[0..35]

### Notes on the sheet
- Resistors!!

## Sheet 6 of 16: Memory
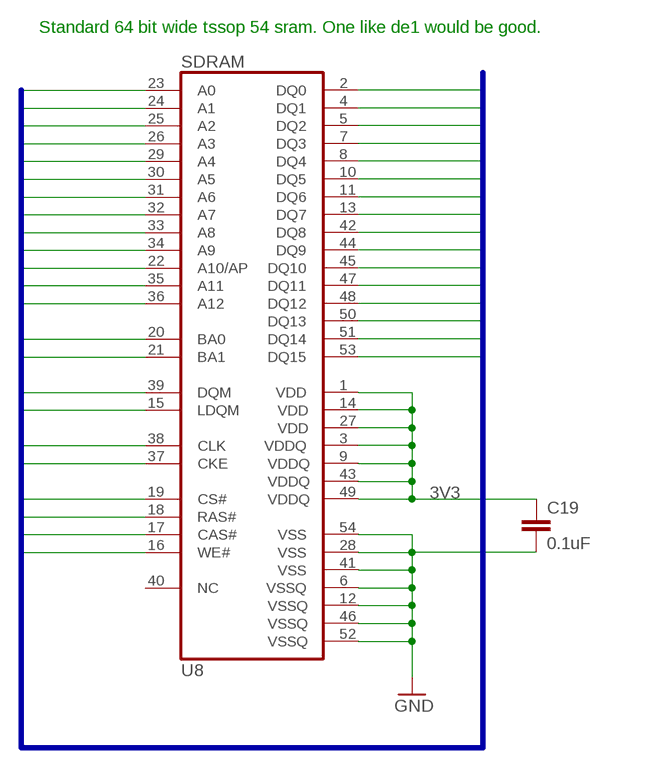
[diagram p6: schematic, sheet 6]

### Parts
C19  0.1uF  C-EUC0805  [C0805]
SDRAM  U8  K4S561632E-TC  [TSOP54]

### Nets
3V3: C19.1 SDRAM.1(VDD) SDRAM.3(VDDQ) SDRAM.9(VDDQ) SDRAM.14(VDD) SDRAM.27(VDD) SDRAM.43(VDDQ) SDRAM.49(VDDQ) ; also sheet 1,2,3,5,8,9,10,11,15,16
A0: SDRAM.23(A0) ; also sheet 1
A1: SDRAM.24(A1) ; also sheet 1
A2: SDRAM.25(A2) ; also sheet 1
A3: SDRAM.26(A3) ; also sheet 1
A4: SDRAM.29(A4) ; also sheet 1
A5: SDRAM.30(A5) ; also sheet 1
A6: SDRAM.31(A6) ; also sheet 1
A7: SDRAM.32(A7) ; also sheet 1
A8: SDRAM.33(A8) ; also sheet 1
A9: SDRAM.34(A9) ; also sheet 1
A10: SDRAM.22(A10/AP) ; also sheet 1
A11: SDRAM.35(A11) ; also sheet 1
A12: SDRAM.36(A12) ; also sheet 1
BA0: SDRAM.20(BA0) ; also sheet 1
BA1: SDRAM.21(BA1) ; also sheet 1
CAS_N: SDRAM.17(CAS#) ; also sheet 1
CKE: SDRAM.37(CKE) ; also sheet 1
CS_N: SDRAM.19(CS#) ; also sheet 1
DQ0: SDRAM.2(DQ0) ; also sheet 1
DQ1: SDRAM.4(DQ1) ; also sheet 1
DQ2: SDRAM.5(DQ2) ; also sheet 1
DQ3: SDRAM.7(DQ3) ; also sheet 1
DQ4: SDRAM.8(DQ4) ; also sheet 1
DQ5: SDRAM.10(DQ5) ; also sheet 1
DQ6: SDRAM.11(DQ6) ; also sheet 1
DQ7: SDRAM.13(DQ7) ; also sheet 1
DQ8: SDRAM.42(DQ8) ; also sheet 1
DQ9: SDRAM.44(DQ9) ; also sheet 1
DQ10: SDRAM.45(DQ10) ; also sheet 1
DQ11: SDRAM.47(DQ11) ; also sheet 1
DQ12: SDRAM.48(DQ12) ; also sheet 1
DQ13: SDRAM.50(DQ13) ; also sheet 1
DQ14: SDRAM.51(DQ14) ; also sheet 1
DQ15: SDRAM.53(DQ15) ; also sheet 1
GND: C19.2 SDRAM.6(VSSQ) SDRAM.12(VSSQ) SDRAM.28(VSS) SDRAM.41(VSS) SDRAM.46(VSSQ) SDRAM.52(VSSQ) SDRAM.54(VSS) ; also sheet 1,2,3,4,5,7,8,9,10,11,12,13,14,15,16
RAS_N: SDRAM.18(RAS#) ; also sheet 1
SDRAM_CLK: SDRAM.38(CLK) ; also sheet 1
SDRAM_LDQM: SDRAM.15(LDQM) ; also sheet 1
SDRAM_UDQM: SDRAM.39(DQM) ; also sheet 1
WE_N: SDRAM.16(WE#) ; also sheet 1
Unconnected: SDRAM.40(NC)

### Buses
SDRAM:A[0..12],DQ[0..15],CS_N,RAS_N,CAS_N,WE_N,SDRAM_CLK,CKE,SDRAM_UDQM,SDRAM_LDQM,BA[0..1]

### Notes on the sheet
- Standard 64 bit wide tssop 54 sram. One like de1 would be good.

## Sheet 7 of 16: USB A/B
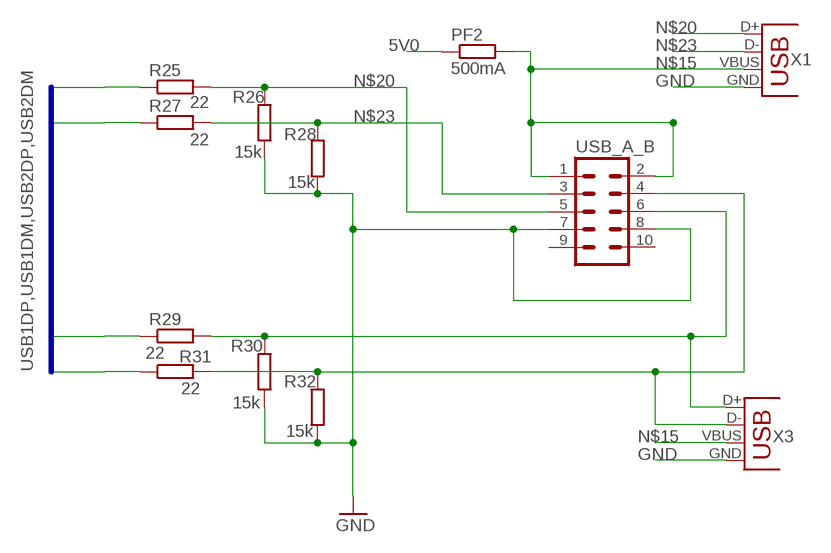
[diagram p7: schematic, sheet 7]

### Parts
PF2  500mA  R-EU_R1206  [R1206]
R25  22  R-EU_R0805  [R0805]
R26  15k  R-EU_R0805  [R0805]
R27  22  R-EU_R0805  [R0805]
R28  15k  R-EU_R0805  [R0805]
R29  22  R-EU_R0805  [R0805]
R30  15k  R-EU_R0805  [R0805]
R31  22  R-EU_R0805  [R0805]
R32  15k  R-EU_R0805  [R0805]
USB_A_B  ML10  [ML10]
X1  USB-A-H  [USB-A-H]
X3  USB-A-H  [USB-A-H]

### Nets
5V0: PF2.1 ; also sheet 1,3,5,9,13,14,15
GND: R26.2 R28.2 R30.2 R32.2 USB_A_B.7 USB_A_B.8 X1.GND X3.GND ; also sheet 1,2,3,4,5,6,8,9,10,11,12,13,14,15,16
N$15: PF2.2 USB_A_B.1 USB_A_B.2 X1.VBUS X3.VBUS
N$20: R25.2 R26.1 USB_A_B.5 X1.D+
N$23: R27.2 R28.1 USB_A_B.3 X1.D-
N$84: R29.2 R30.1 USB_A_B.6 X3.D+
N$87: R31.2 R32.1 USB_A_B.4 X3.D-
USB1DM: R27.1 ; also sheet 1
USB1DP: R25.1 ; also sheet 1
USB2DM: R31.1 ; also sheet 1
USB2DP: R29.1 ; also sheet 1
Unconnected: USB_A_B.9 USB_A_B.10

### Buses
USB1DP,USB1DM,USB2DP,USB2DM

## Sheet 8 of 16: DAC decoupling
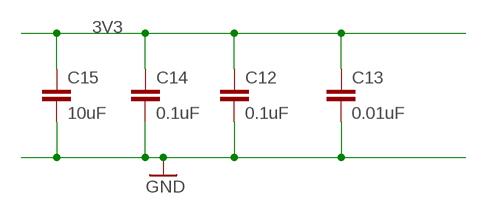
[diagram p8: schematic, sheet 8]

### Parts
C12  0.1uF  C-EUC0805  [C0805]
C13  0.01uF  C-EUC0805  [C0805]
C14  0.1uF  C-EUC0805  [C0805]
C15  10uF  C-EUC0805  [C0805]

### Nets
3V3: C12.1 C13.1 C14.1 C15.1 ; also sheet 1,2,3,5,6,9,10,11,15,16
GND: C12.2 C13.2 C14.2 C15.2 ; also sheet 1,2,3,4,5,6,7,9,10,11,12,13,14,15,16

## Sheet 9 of 16: Voltage regulation
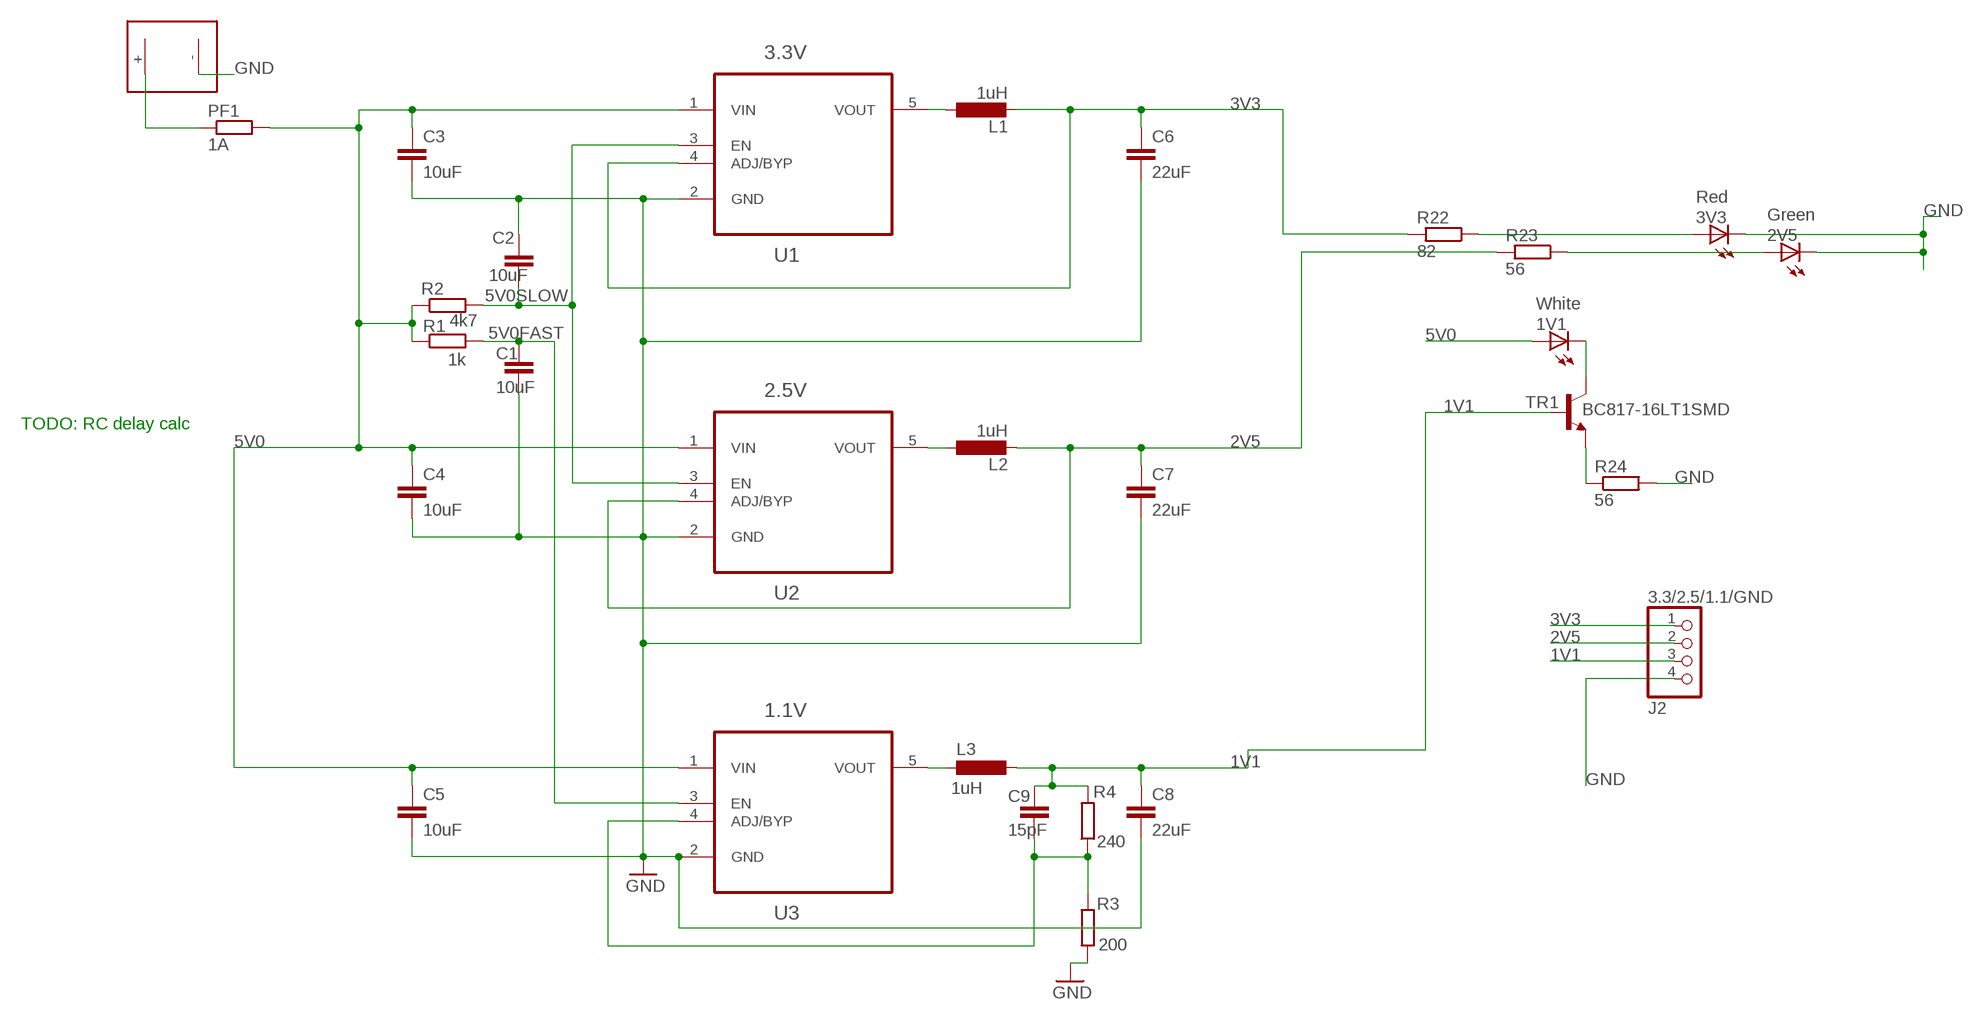
[diagram p9: schematic, sheet 9]

### Parts
1.1V  U3  SPX3819M5-L-5-0  [SOT95P280X145-5N]
1V1  White  LEDCHIP-LED0805  [CHIP-LED0805]
2.5V  U2  SPX3819M5-L-5-0  [SOT95P280X145-5N]
2V5  Green  LEDCHIP-LED0805  [CHIP-LED0805]
3.3/2.5/1.1/GND  J2  PINHD-1X4  [1X04]
3.3V  U1  SPX3819M5-L-5-0  [SOT95P280X145-5N]
3V3  Red  LEDCHIP-LED0805  [CHIP-LED0805]
C1  10uF  C-EUC0805  [C0805]
C2  10uF  C-EUC0805  [C0805]
C3  10uF  C-EUC0805  [C0805]
C4  10uF  C-EUC0805  [C0805]
C5  10uF  C-EUC0805  [C0805]
C6  22uF  C-EUC0805  [C0805]
C7  22uF  C-EUC0805  [C0805]
C8  22uF  C-EUC0805  [C0805]
C9  15pF  C-EUC0805  [C0805]
L1  1uH  L-EUL3225M  [L3225M]
L2  1uH  L-EUL3225M  [L3225M]
L3  1uH  L-EUL3225M  [L3225M]
PF1  1A  R-EU_R1206  [R1206]
R1  1k  R-EU_R0805  [R0805]
R2  4k7  R-EU_R0805  [R0805]
R3  200  R-EU_R0805  [R0805]
R4  240  R-EU_R0805  [R0805]
R22  82  R-EU_R0805  [R0805]
R23  56  R-EU_R0805  [R0805]
R24  56  R-EU_R0805  [R0805]
TR1  BC817-16LT1SMD  [SOT23-BEC]
U$6  MOLEX_PS  [MOLEX_PS]

### Nets
1V1: 3.3/2.5/1.1/GND.3 C8.1 C9.1 L3.2 R4.2 TR1.B ; also sheet 1,2
2V5: 2.5V.4(ADJ/BYP) 3.3/2.5/1.1/GND.2 C7.1 L2.2 R23.2 ; also sheet 1,2
3V3: 3.3/2.5/1.1/GND.1 3.3V.4(ADJ/BYP) C6.1 L1.2 R22.2 ; also sheet 1,2,3,5,6,8,10,11,15,16
5V0: 1.1V.1(VIN) 1V1.A 2.5V.1(VIN) 3.3V.1(VIN) C3.1 C4.1 C5.1 PF1.2 R1.1 R2.1 ; also sheet 1,3,5,7,13,14,15
5V0FAST: 1.1V.3(EN) C1.1 R1.2
5V0SLOW: 2.5V.3(EN) 3.3V.3(EN) C2.2 R2.2
GND: 1.1V.2(GND) 2.5V.2(GND) 2V5.C 3.3/2.5/1.1/GND.4 3.3V.2(GND) 3V3.C C1.2 C2.1 C3.2 C4.2 C5.2 C6.2 C7.2 C8.2 R3.1 R24.2 U$6.-(--) ; also sheet 1,2,3,4,5,6,7,8,10,11,12,13,14,15,16
N$2: PF1.1 U$6.+
N$63: 3V3.A R22.1
N$80: 2V5.A R23.1
N$82: 1V1.C TR1.C
N$88: R24.1 TR1.E
N$135: 1.1V.5(VOUT) L3.1
N$136: 2.5V.5(VOUT) L2.1
N$137: 3.3V.5(VOUT) L1.1
N$145: 1.1V.4(ADJ/BYP) C9.2 R3.2 R4.1

### Notes on the sheet
- TODO: RC delay calc

## Sheet 10 of 16: SD card
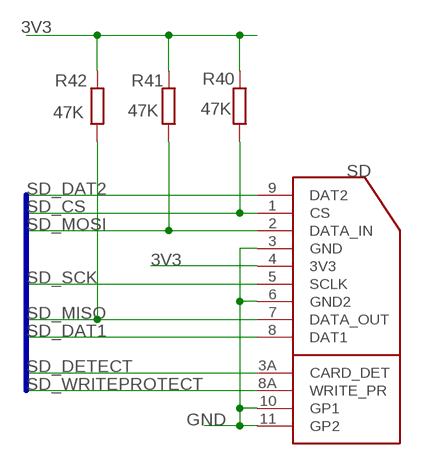
[diagram p10: schematic, sheet 10]

### Parts
R40  47K  R-EU_M0805  [M0805]
R41  47K  R-EU_M0805  [M0805]
R42  47K  R-EU_M0805  [M0805]
SD  SDSOCKET  [SDSOCKET]

### Nets
3V3: R40.2 R41.2 R42.2 SD.4(3V3) ; also sheet 1,2,3,5,6,8,9,11,15,16
GND: SD.3(GND) SD.6(GND2) SD.10(GP1) SD.11(GP2) ; also sheet 1,2,3,4,5,6,7,8,9,11,12,13,14,15,16
SD_CS: R40.1 SD.1(CS) ; also sheet 1
SD_DAT1: SD.8(DAT1) ; also sheet 1
SD_DAT2: SD.9(DAT2) ; also sheet 1
SD_DETECT: SD.3A(CARD_DET) ; also sheet 1
SD_MISO: R42.1 SD.7(DATA_OUT) ; also sheet 1
SD_MOSI: R41.1 SD.2(DATA_IN) ; also sheet 1
SD_SCK: SD.5(SCLK) ; also sheet 1
SD_WRITEPROTECT: SD.8A(WRITE_PR) ; also sheet 1

### Buses
SD_DETECT,SD_WRITEPROTECT,SD_CS,SD_MISO,SD_MOSI,SD_SCK,SD_DAT1,SD_DAT2

## Sheet 11 of 16: ADC
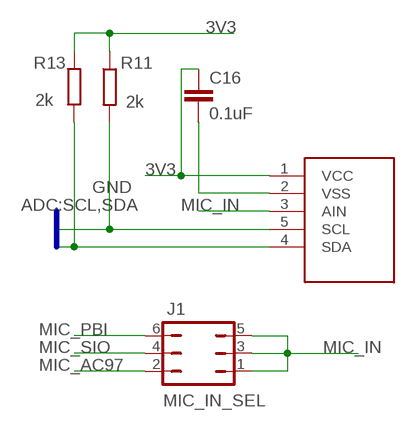
[diagram p11: schematic, sheet 11]

### Parts
ADC  U4  MCP3021  [SOT95P280X145-5N]
C16  0.1uF  C-EUC0805  [C0805]
MIC_IN_SEL  J1  JP3Q  [JP3Q]
R11  2k  R-EU_M0805  [M0805]
R13  2k  R-EU_M0805  [M0805]

### Nets
3V3: ADC.1(VCC) C16.1 R11.1 R13.2 ; also sheet 1,2,3,5,6,8,9,10,15,16
GND: ADC.2(VSS) C16.2 ; also sheet 1,2,3,4,5,6,7,8,9,10,12,13,14,15,16
MIC_AC97: MIC_IN_SEL.2 ; also sheet 4
MIC_IN: ADC.3(AIN) MIC_IN_SEL.1 MIC_IN_SEL.3 MIC_IN_SEL.5
MIC_PBI: MIC_IN_SEL.6 ; also sheet 14
MIC_SIO: MIC_IN_SEL.4 ; also sheet 13
SCL: ADC.5(SCL) R11.2 ; also sheet 1
SDA: ADC.4(SDA) R13.1 ; also sheet 1

### Buses
ADC:SCL,SDA

## Sheet 12 of 16: Mounting
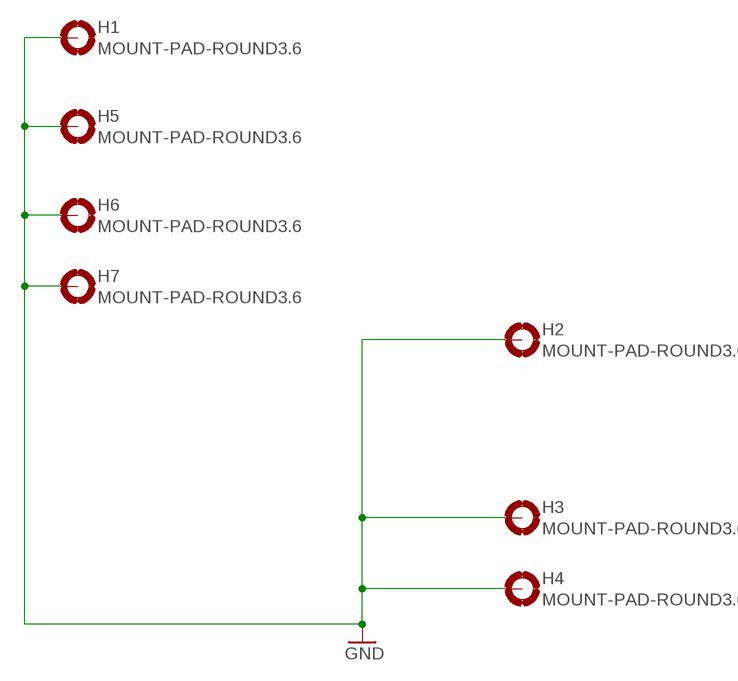
[diagram p12: schematic, sheet 12]

### Parts
H1  MOUNT-PAD-ROUND3.6  [3,6-PAD]
H2  MOUNT-PAD-ROUND3.6  [3,6-PAD]
H3  MOUNT-PAD-ROUND3.6  [3,6-PAD]
H4  MOUNT-PAD-ROUND3.6  [3,6-PAD]
H5  MOUNT-PAD-ROUND3.6  [3,6-PAD]
H6  MOUNT-PAD-ROUND3.6  [3,6-PAD]
H7  MOUNT-PAD-ROUND3.6  [3,6-PAD]

### Nets
GND: H1.B3,6(MOUNT) H2.B3,6(MOUNT) H3.B3,6(MOUNT) H4.B3,6(MOUNT) H5.B3,6(MOUNT) H6.B3,6(MOUNT) H7.B3,6(MOUNT) ; also sheet 1,2,3,4,5,6,7,8,9,10,11,13,14,15,16

## Sheet 13 of 16: S.I.O.
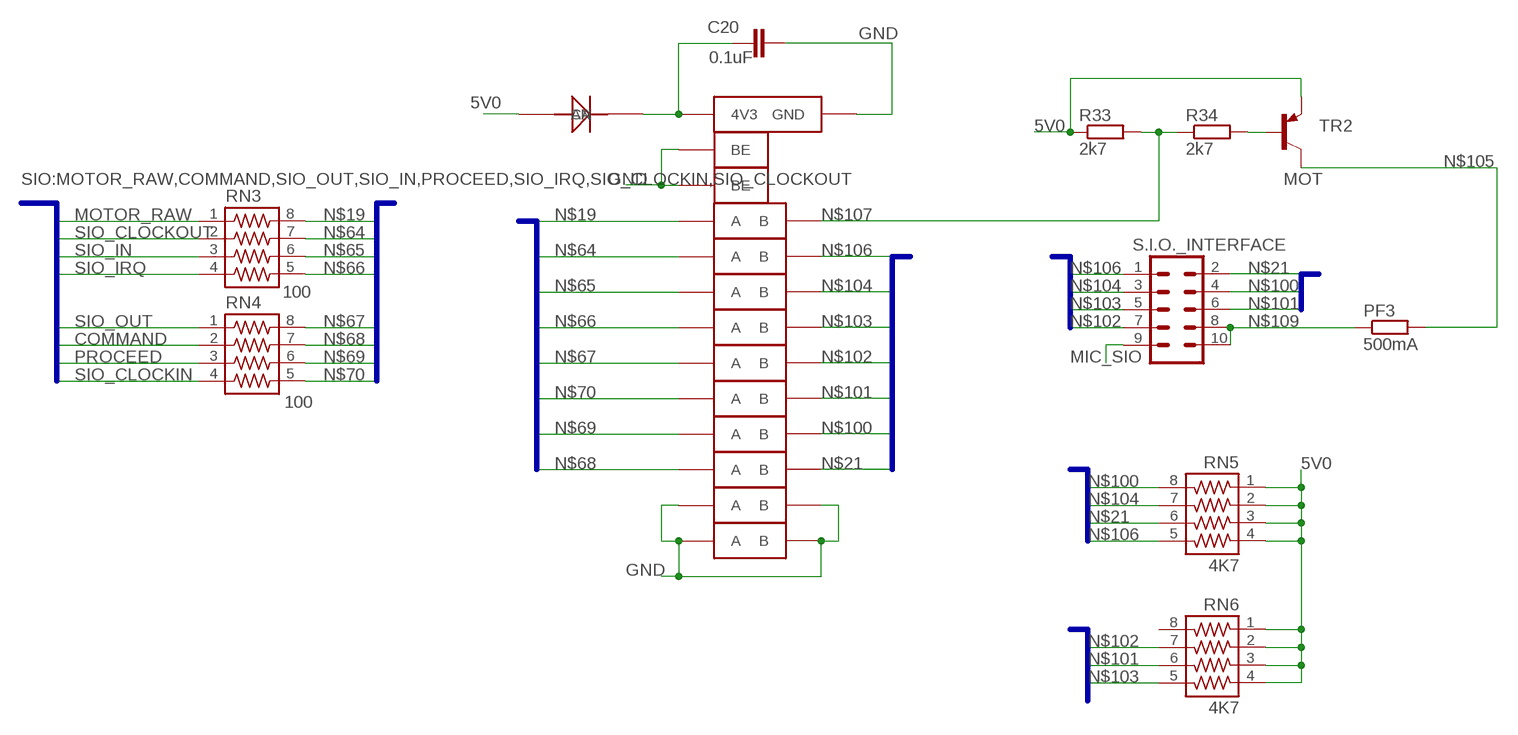
[diagram p13: schematic, sheet 13]

### Parts
C20  0.1uF  C-EUC0805K  [C0805K]
D1  1N4148  [SOD123]
PF3  500mA  R-EU_R1206  [R1206]
QS3384  U9  QS3384  [TSSOP24]
R33  2k7  R-EU_M0805  [M0805]
R34  2k7  R-EU_M0805  [M0805]
RN3  100  742-8742_3  [743-8]
RN4  100  742-8742_3  [743-8]
RN5  4K7  742-8742_3  [743-8]
RN6  4K7  742-8742_3  [743-8]
S.I.O._INTERFACE  ML10  [ML10]
TR2  MOT  BC857ASMD  [SOT23-BEC]

### Nets
5V0: D1.2(AN) R33.1 RN5.1 RN5.2 RN5.3 RN5.4 RN6.1 RN6.2 RN6.3 RN6.4 TR2.E ; also sheet 1,3,5,7,9,14,15
COMMAND: RN4.2 ; also sheet 1
GND: C20.2 QS3384.1(BEA:BE) QS3384.12(GND) QS3384.13(BEB:BE) QS3384.20(B) QS3384.21(A) QS3384.22(A) QS3384.23(B) ; also sheet 1,2,3,4,5,6,7,8,9,10,11,12,14,15,16
MIC_SIO: S.I.O._INTERFACE.9 ; also sheet 11
MOTOR_RAW: RN3.1 ; also sheet 1
N$19: QS3384.3(A) RN3.8
N$21: QS3384.19(B) RN5.6 S.I.O._INTERFACE.2
N$64: QS3384.4(A) RN3.7
N$65: QS3384.7(A) RN3.6
N$66: QS3384.8(A) RN3.5
N$67: QS3384.11(A) RN4.8
N$68: QS3384.18(A) RN4.7
N$69: QS3384.17(A) RN4.6
N$70: QS3384.14(A) RN4.5
N$99: R34.2 TR2.B
N$100: QS3384.16(B) RN5.8 S.I.O._INTERFACE.4
N$101: QS3384.15(B) RN6.6 S.I.O._INTERFACE.6
N$102: QS3384.10(B) RN6.7 S.I.O._INTERFACE.7
N$103: QS3384.9(B) RN6.5 S.I.O._INTERFACE.5
N$104: QS3384.6(B) RN5.7 S.I.O._INTERFACE.3
N$105: PF3.2 TR2.C
N$106: QS3384.5(B) RN5.5 S.I.O._INTERFACE.1
N$107: QS3384.2(B) R33.2 R34.1
N$108: C20.1 D1.1(CA) QS3384.24(4V3)
N$109: PF3.1 S.I.O._INTERFACE.8 S.I.O._INTERFACE.10
PROCEED: RN4.3 ; also sheet 1
SIO_CLOCKIN: RN4.4 ; also sheet 1
SIO_CLOCKOUT: RN3.2 ; also sheet 1
SIO_IN: RN3.3 ; also sheet 1
SIO_IRQ: RN3.4 ; also sheet 1
SIO_OUT: RN4.1 ; also sheet 1
Unconnected: RN6.8

### Buses
SIO:MOTOR_RAW,COMMAND,SIO_OUT,SIO_IN,PROCEED,SIO_IRQ,SIO_CLOCKIN,SIO_CLOCKOUT
N$21,N$100,N$101,N$102,N$103,N$104,N$106
N$19,N$64,N$65,N$66,N$67,N$68,N$69,N$70

## Sheet 14 of 16: Cartridge / P.B.I
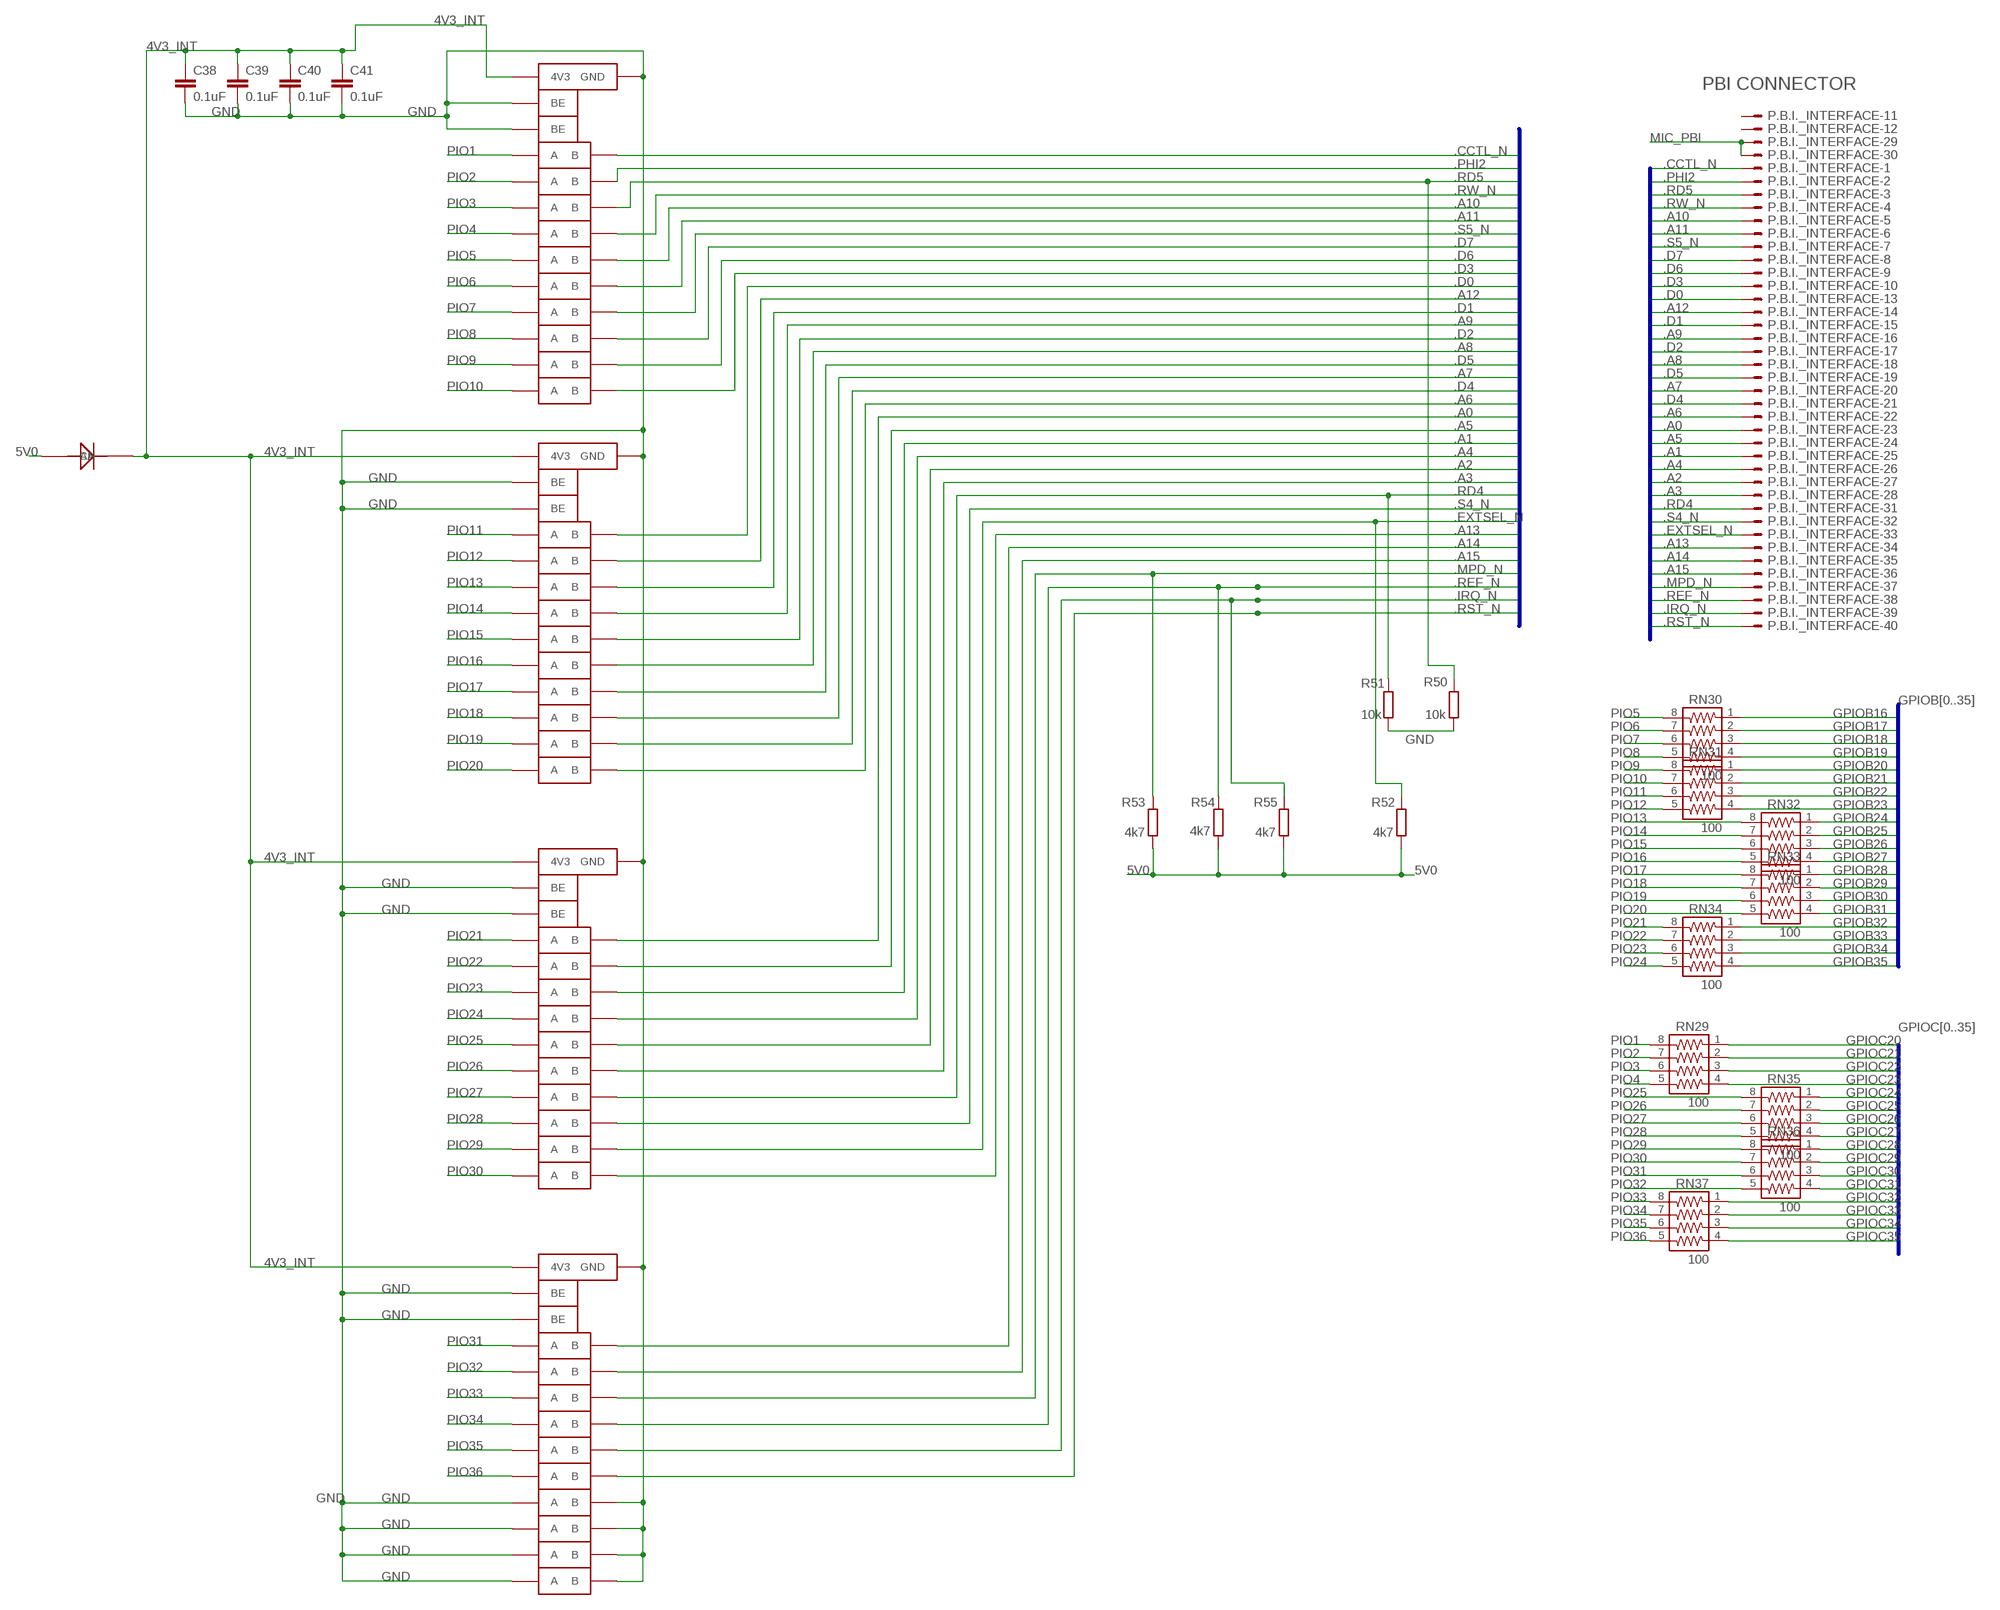
[diagram p14: schematic, sheet 14]

### Parts
C38  0.1uF  C-EUC0805K  [C0805K]
C39  0.1uF  C-EUC0805K  [C0805K]
C40  0.1uF  C-EUC0805K  [C0805K]
C41  0.1uF  C-EUC0805K  [C0805K]
D3  1N4148  [SOD123]
IC1  U14  QS3384  [TSSOP24]
IC2  U15  QS3384  [TSSOP24]
IC3  U16  QS3384  [TSSOP24]
IC4  U17  QS3384  [TSSOP24]
P.B.I._INTERFACE  ML40E  [ML40]
R50  10k  R-EU_M0805  [M0805]
R51  10k  R-EU_M0805  [M0805]
R52  4k7  R-EU_M0805  [M0805]
R53  4k7  R-EU_M0805  [M0805]
R54  4k7  R-EU_M0805  [M0805]
R55  4k7  R-EU_M0805  [M0805]
RN29  100  742-8742_3  [743-8]
RN30  100  742-8742_3  [743-8]
RN31  100  742-8742_3  [743-8]
RN32  100  742-8742_3  [743-8]
RN33  100  742-8742_3  [743-8]
RN34  100  742-8742_3  [743-8]
RN35  100  742-8742_3  [743-8]
RN36  100  742-8742_3  [743-8]
RN37  100  742-8742_3  [743-8]

### Nets
4V3_INT: C38.1 C39.1 C40.1 C41.1 D3.1(CA) IC1.24(4V3) IC2.24(4V3) IC3.24(4V3) IC4.24(4V3)
5V0: D3.2(AN) R52.1 R53.1 R54.1 R55.1 ; also sheet 1,3,5,7,9,13,15
.A0: IC3.2(B) P.B.I._INTERFACE.23
.A1: IC3.6(B) P.B.I._INTERFACE.25
.A2: IC3.10(B) P.B.I._INTERFACE.27
.A3: IC3.15(B) P.B.I._INTERFACE.28
.A4: IC3.9(B) P.B.I._INTERFACE.26
.A5: IC3.5(B) P.B.I._INTERFACE.24
.A6: IC2.23(B) P.B.I._INTERFACE.22
.A7: IC2.19(B) P.B.I._INTERFACE.20
.A8: IC2.15(B) P.B.I._INTERFACE.18
.A9: IC2.9(B) P.B.I._INTERFACE.16
.A10: IC1.10(B) P.B.I._INTERFACE.5
.A11: IC1.15(B) P.B.I._INTERFACE.6
.A12: IC2.5(B) P.B.I._INTERFACE.14
.A13: IC3.23(B) P.B.I._INTERFACE.34
.A14: IC4.2(B) P.B.I._INTERFACE.35
.A15: IC4.5(B) P.B.I._INTERFACE.36
.CCTL_N: IC1.2(B) P.B.I._INTERFACE.1
.D0: IC2.2(B) P.B.I._INTERFACE.13
.D1: IC2.6(B) P.B.I._INTERFACE.15
.D2: IC2.10(B) P.B.I._INTERFACE.17
.D3: IC1.23(B) P.B.I._INTERFACE.10
.D4: IC2.20(B) P.B.I._INTERFACE.21
.D5: IC2.16(B) P.B.I._INTERFACE.19
.D6: IC1.20(B) P.B.I._INTERFACE.9
.D7: IC1.19(B) P.B.I._INTERFACE.8
.EXTSEL_N: IC3.20(B) P.B.I._INTERFACE.33 R52.2
.IRQ_N: IC4.10(B) P.B.I._INTERFACE.39 R55.2
.MPD_N: IC4.6(B) P.B.I._INTERFACE.37 R53.2
.PHI2: IC1.5(B) P.B.I._INTERFACE.2
.RD4: IC3.16(B) P.B.I._INTERFACE.31 R51.2
.RD5: IC1.6(B) P.B.I._INTERFACE.3 R50.2
.REF_N: IC4.9(B) P.B.I._INTERFACE.38 R54.2
.RST_N: IC4.15(B) P.B.I._INTERFACE.40
.RW_N: IC1.9(B) P.B.I._INTERFACE.4
.S4_N: IC3.19(B) P.B.I._INTERFACE.32
.S5_N: IC1.16(B) P.B.I._INTERFACE.7
GND: C38.2 C39.2 C40.2 C41.2 IC1.1(BEA:BE) IC1.12(GND) IC1.13(BEB:BE) IC2.1(BEA:BE) IC2.12(GND) IC2.13(BEB:BE) IC3.1(BEA:BE) IC3.12(GND) IC3.13(BEB:BE) IC4.1(BEA:BE) IC4.12(GND) IC4.13(BEB:BE) IC4.16(B) IC4.17(A) IC4.18(A) IC4.19(B) IC4.20(B) IC4.21(A) IC4.22(A) IC4.23(B) R50.1 R51.1 ; also sheet 1,2,3,4,5,6,7,8,9,10,11,12,13,15,16
GPIOB16: RN30.1 ; also sheet 1
GPIOB17: RN30.2 ; also sheet 1
GPIOB18: RN30.3 ; also sheet 1
GPIOB19: RN30.4 ; also sheet 1
GPIOB20: RN31.1 ; also sheet 1
GPIOB21: RN31.2 ; also sheet 1
GPIOB22: RN31.3 ; also sheet 1
GPIOB23: RN31.4 ; also sheet 1
GPIOB24: RN32.1 ; also sheet 1
GPIOB25: RN32.2 ; also sheet 1
GPIOB26: RN32.3 ; also sheet 1
GPIOB27: RN32.4 ; also sheet 1
GPIOB28: RN33.1 ; also sheet 1
GPIOB29: RN33.2 ; also sheet 1
GPIOB30: RN33.3 ; also sheet 1
GPIOB31: RN33.4 ; also sheet 1
GPIOB32: RN34.1 ; also sheet 1
GPIOB33: RN34.2 ; also sheet 1
GPIOB34: RN34.3 ; also sheet 1
GPIOB35: RN34.4 ; also sheet 1
GPIOC20: RN29.1 ; also sheet 1
GPIOC21: RN29.2 ; also sheet 1
GPIOC22: RN29.3 ; also sheet 1
GPIOC23: RN29.4 ; also sheet 1
GPIOC24: RN35.1 ; also sheet 1
GPIOC25: RN35.2 ; also sheet 1
GPIOC26: RN35.3 ; also sheet 1
GPIOC27: RN35.4 ; also sheet 1
GPIOC28: RN36.1 ; also sheet 1
GPIOC29: RN36.2 ; also sheet 1
GPIOC30: RN36.3 ; also sheet 1
GPIOC31: RN36.4 ; also sheet 1
GPIOC32: RN37.1 ; also sheet 1
GPIOC33: RN37.2 ; also sheet 1
GPIOC34: RN37.3 ; also sheet 1
GPIOC35: RN37.4 ; also sheet 1
MIC_PBI: P.B.I._INTERFACE.29 P.B.I._INTERFACE.30 ; also sheet 11
PIO1: IC1.3(A) RN29.8
PIO2: IC1.4(A) RN29.7
PIO3: IC1.7(A) RN29.6
PIO4: IC1.8(A) RN29.5
PIO5: IC1.11(A) RN30.8
PIO6: IC1.14(A) RN30.7
PIO7: IC1.17(A) RN30.6
PIO8: IC1.18(A) RN30.5
PIO9: IC1.21(A) RN31.8
PIO10: IC1.22(A) RN31.7
PIO11: IC2.3(A) RN31.6
PIO12: IC2.4(A) RN31.5
PIO13: IC2.7(A) RN32.8
PIO14: IC2.8(A) RN32.7
PIO15: IC2.11(A) RN32.6
PIO16: IC2.14(A) RN32.5
PIO17: IC2.17(A) RN33.8
PIO18: IC2.18(A) RN33.7
PIO19: IC2.21(A) RN33.6
PIO20: IC2.22(A) RN33.5
PIO21: IC3.3(A) RN34.8
PIO22: IC3.4(A) RN34.7
PIO23: IC3.7(A) RN34.6
PIO24: IC3.8(A) RN34.5
PIO25: IC3.11(A) RN35.8
PIO26: IC3.14(A) RN35.7
PIO27: IC3.17(A) RN35.6
PIO28: IC3.18(A) RN35.5
PIO29: IC3.21(A) RN36.8
PIO30: IC3.22(A) RN36.7
PIO31: IC4.3(A) RN36.6
PIO32: IC4.4(A) RN36.5
PIO33: IC4.7(A) RN37.8
PIO34: IC4.8(A) RN37.7
PIO35: IC4.11(A) RN37.6
PIO36: IC4.14(A) RN37.5
Unconnected: P.B.I._INTERFACE.11 P.B.I._INTERFACE.12

### Buses
.A[0..15],.D[0..7],.CAS_N,.RW_N,.RAS_N,.RDY_N,.CASINH_N,.REF_N,.PHI2,.MPD_N,.EXTSEL_N,.AUDIO,.RST_N,.IRQ_N,.CCTL_N,.S4_N,.S5_N,.RD4,.RD5
GPIOB[0..35]
GPIOC[0..35]

### Notes on the sheet
- PBI CONNECTOR

## Sheet 15 of 16: Controllers
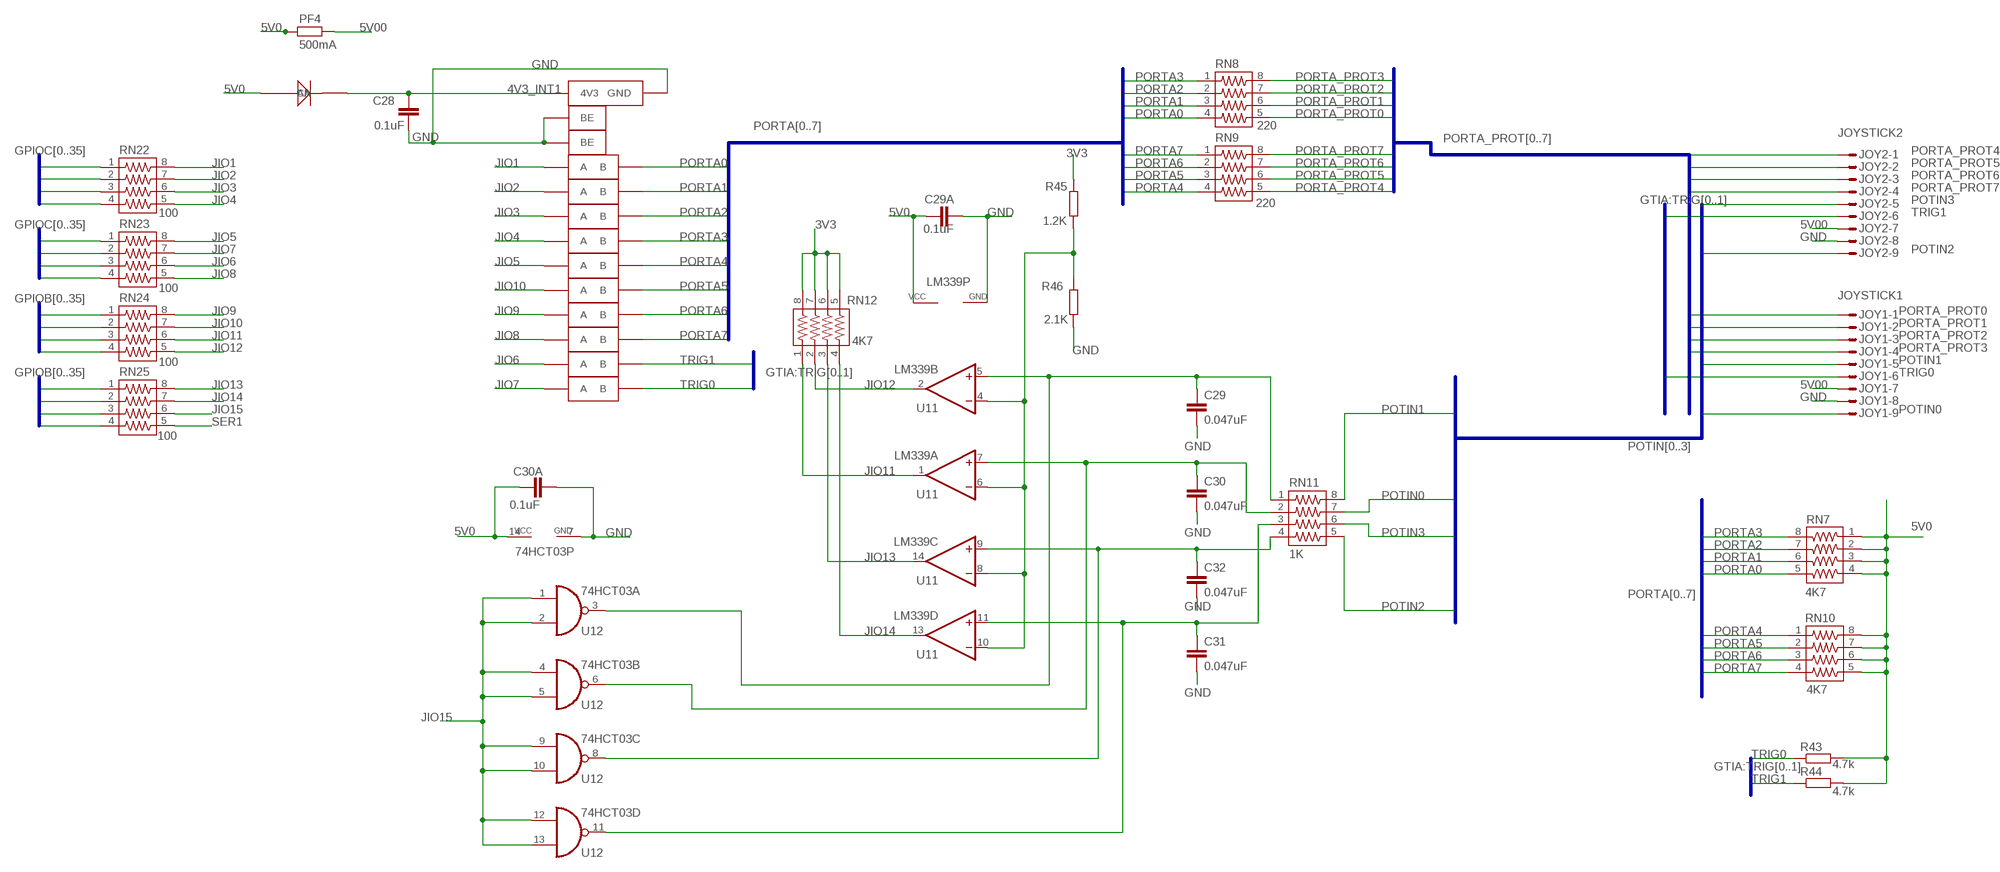
[diagram p15: schematic, sheet 15]

### Parts
74HCT03  U12  74HCT03D  [SO14]
C28  0.1uF  C-EUC0805K  [C0805K]
C29  0.047uF  C-EUC0805K  [C0805K]
C29A  0.1uF  C-EUC0805K  [C0805K]
C30  0.047uF  C-EUC0805K  [C0805K]
C30A  0.1uF  C-EUC0805K  [C0805K]
C31  0.047uF  C-EUC0805K  [C0805K]
C32  0.047uF  C-EUC0805K  [C0805K]
D2  1N4148  [SOD123]
IC5  U10  QS3384  [TSSOP24]
JOY1  JOYSTICK1  M09HPS  [M09HP]
JOY2  JOYSTICK2  M09HPS  [M09HP]
LM339  U11  LM339  [TSSOP-14]
PF4  500mA  R-EU_R1206  [R1206]
R43  4.7k  R-EU_M0805  [M0805]
R44  4.7k  R-EU_M0805  [M0805]
R45  1.2K  R-EU_R0805  [R0805]
R46  2.1K  R-EU_R0805  [R0805]
RN7  4K7  742-8742_3  [743-8]
RN8  220  742-8742_3  [743-8]
RN9  220  742-8742_3  [743-8]
RN10  4K7  742-8742_3  [743-8]
RN11  1K  742-8742_3  [743-8]
RN12  4K7  742-8742_3  [743-8]
RN22  100  742-8742_3  [743-8]
RN23  100  742-8742_3  [743-8]
RN24  100  742-8742_3  [743-8]
RN25  100  742-8742_3  [743-8]

### Nets
3V3: R45.2 RN12.5 RN12.6 RN12.7 RN12.8 ; also sheet 1,2,3,5,6,8,9,10,11,16
4V3_INT1: C28.2 D2.1(CA) IC5.24(4V3)
5V0: 74HCT03.14(P:VCC) C29A.1 C30A.1 D2.2(AN) LM339.3(P:VCC) PF4.1 R43.2 R44.2 RN7.1 RN7.2 RN7.3 RN7.4 RN10.5 RN10.6 RN10.7 RN10.8 ; also sheet 1,3,5,7,9,13,14
5V00: JOY1.7 JOY2.7 PF4.2
GND: 74HCT03.7(P:GND) C28.1 C29.2 C29A.2 C30.2 C30A.2 C31.2 C32.2 IC5.1(BEA:BE) IC5.12(GND) IC5.13(BEB:BE) JOY1.8 JOY2.8 LM339.12(P:GND) R46.1 ; also sheet 1,2,3,4,5,6,7,8,9,10,11,12,13,14,16
GPIOB0: RN24.1 ; also sheet 1
GPIOB1: RN24.2 ; also sheet 1
GPIOB2: RN24.3 ; also sheet 1
GPIOB3: RN24.4 ; also sheet 1
GPIOB4: RN25.1 ; also sheet 1
GPIOB5: RN25.2 ; also sheet 1
GPIOB6: RN25.3 ; also sheet 1
GPIOB7: RN25.4 ; also sheet 1
GPIOC8: RN22.1 ; also sheet 1
GPIOC9: RN22.2 ; also sheet 1
GPIOC10: RN22.3 ; also sheet 1
GPIOC11: RN22.4 ; also sheet 1
GPIOC12: RN23.1 ; also sheet 1
GPIOC13: RN23.3 ; also sheet 1
GPIOC14: RN23.2 ; also sheet 1
GPIOC15: RN23.4 ; also sheet 1
JIO1: IC5.3(A) RN22.8
JIO2: IC5.4(A) RN22.7
JIO3: IC5.7(A) RN22.6
JIO4: IC5.8(A) RN22.5
JIO5: IC5.11(A) RN23.8
JIO6: IC5.21(A) RN23.6
JIO7: IC5.22(A) RN23.7
JIO8: IC5.18(A) RN23.5
JIO9: IC5.17(A) RN24.8
JIO10: IC5.14(A) RN24.7
JIO11: LM339.1(A:OUT) RN12.1 RN24.6
JIO12: LM339.2(B:OUT) RN12.2 RN24.5
JIO13: LM339.14(C:OUT) RN12.3 RN25.8
JIO14: LM339.13(D:OUT) RN12.4 RN25.7
JIO15: 74HCT03.1(A:I0) 74HCT03.2(A:I1) 74HCT03.4(B:I0) 74HCT03.5(B:I1) 74HCT03.9(C:I0) 74HCT03.10(C:I1) 74HCT03.12(D:I0) 74HCT03.13(D:I1) RN25.6
N$73: LM339.4(B:-IN) LM339.6(A:-IN) LM339.8(C:-IN) LM339.10(D:-IN) R45.1 R46.2
PORTA0: IC5.2(B) RN7.5 RN8.4
PORTA1: IC5.5(B) RN7.6 RN8.3
PORTA2: IC5.6(B) RN7.7 RN8.2
PORTA3: IC5.9(B) RN7.8 RN8.1
PORTA4: IC5.10(B) RN9.4 RN10.1
PORTA5: IC5.15(B) RN9.3 RN10.2
PORTA6: IC5.16(B) RN9.2 RN10.3
PORTA7: IC5.19(B) RN9.1 RN10.4
PORTA_PROT0: JOY1.1 RN8.5
PORTA_PROT1: JOY1.2 RN8.6
PORTA_PROT2: JOY1.3 RN8.7
PORTA_PROT3: JOY1.4 RN8.8
PORTA_PROT4: JOY2.1 RN9.5
PORTA_PROT5: JOY2.2 RN9.6
PORTA_PROT6: JOY2.3 RN9.7
PORTA_PROT7: JOY2.4 RN9.8
POT0: 74HCT03.3(A:O) C29.1 LM339.5(B:+IN) RN11.1
POT1: 74HCT03.6(B:O) C30.1 LM339.7(A:+IN) RN11.2
POT2: 74HCT03.8(C:O) C32.1 LM339.9(C:+IN) RN11.4
POT3: 74HCT03.11(D:O) C31.1 LM339.11(D:+IN) RN11.3
POTIN0: JOY1.9 RN11.7
POTIN1: JOY1.5 RN11.8
POTIN2: JOY2.9 RN11.5
POTIN3: JOY2.5 RN11.6
SER1: RN25.5 ; also sheet 16
TRIG0: IC5.23(B) JOY1.6 R43.1
TRIG1: IC5.20(B) JOY2.6 R44.1

### Buses
PORTA[0..7]
GTIA:TRIG[0..1]
POTIN[0..3]
PORTA_PROT[0..7]
GPIOC[0..35]
GPIOB[0..35]

## Sheet 16 of 16: Serial I/O
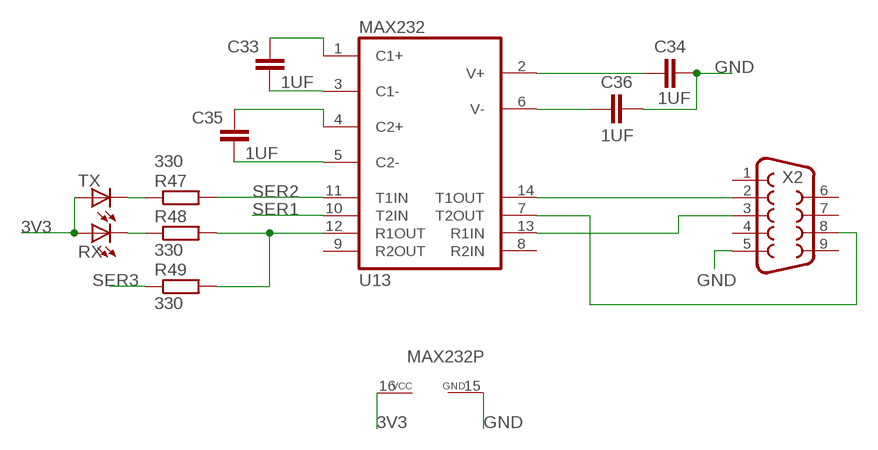
[diagram p16: schematic, sheet 16]

### Parts
C33  1UF  C-EUC0805K  [C0805K]
C34  1UF  C-EUC0805K  [C0805K]
C35  1UF  C-EUC0805K  [C0805K]
C36  1UF  C-EUC0805K  [C0805K]
MAX232  U13  MAX232ECWE  [SO16L]
R47  330  R-EU_M0805  [M0805]
R48  330  R-EU_M0805  [M0805]
R49  330  R-EU_M0805  [M0805]
RX  LEDCHIP-LED0805  [CHIP-LED0805]
TX  LEDCHIP-LED0805  [CHIP-LED0805]
X2  F09V  [F09V]

### Nets
3V3: MAX232.16(VCC) RX.A TX.A ; also sheet 1,2,3,5,6,8,9,10,11,15
GND: C34.2 C36.2 MAX232.15(GND) X2.5 ; also sheet 1,2,3,4,5,6,7,8,9,10,11,12,13,14,15
N$25: R47.1 TX.C
N$26: R48.1 RX.C
N$71: C34.1 MAX232.2(V+)
N$72: C33.2 MAX232.3(C1-)
N$74: C35.2 MAX232.5(C2-)
N$75: C33.1 MAX232.1(C1+)
N$76: C35.1 MAX232.4(C2+)
N$77: C36.1 MAX232.6(V-)
N$78: MAX232.14(T1OUT) X2.2
N$79: MAX232.13(R1IN) X2.3
N$83: MAX232.7(T2OUT) X2.8
N$85: MAX232.12(R1OUT) R48.2 R49.2
SER1: MAX232.10(T2IN) ; also sheet 15
SER2: MAX232.11(T1IN) R47.2 ; also sheet 5
SER3: R49.1 ; also sheet 5
Unconnected: MAX232.8(R2IN) MAX232.9(R2OUT) X2.1 X2.4 X2.6 X2.7 X2.9

## Library data of the parts
1.1V 2.5V 3.3V = Exar_By_element14_Batch_1:SPX3819M5-L-5-0: 500mA, LOW-NOISE LDO VOLTAGE REGULATOR; MPN: SPX3819M5-L-5-0; OC_FARNELL: 1829408; OC_NEWARK: 84R4417; PACKAGE: SOT-23-5; SUPPLIER: EXAR
1V1 2V5 3V3 RX TX = led:LED: LED OSRAM: - CHIPLED LG R971, LG N971, LY N971, LG Q971, LY Q971, LO R971, LY R971 LH N974, LH R974 LS Q976, LO Q976, LY Q976 LO Q996 - Hyper CHIPLED LW Q18S LB Q993, LB Q99A, LB R99A - SideLED LS A670, LO A670, LY A670, LG A670, LP A670 LB A673, LV A673, LT A673, LW A673 LH A674 LY A675 LS A676, LA A676, LO A676, LY A676, LW A676 LS A679, LY A679, LG A679 - Hyper Micro SIDELED® LS Y876, LA Y876, LO Y876, LY Y876 LT Y87S - SmartLED LW L88C, LW L88S LB L89C, LB L89S, LG L890 LS L89K, LO L89K, LY L89K LS L896, LA L896, LO L896, LY L896 - TOPLED LS T670, LO T670, LY T670, LG T670, LP T670 LSG T670, LSP T670, LSY T670, LOP T670, LYG T670 LG T671, LOG T671, LSG T671 LB T673, LV T673, LT T673, LW T673 LH T674 LS T676, LA T676, LO T676, LY T676, LB T676, LH T676, LSB T676, LW T676 LB T67C, LV T67C, LT T67C, LS T67K, LO T67K, LY T67K, LW E67C LS E67B, LA E67B, LO E67B, LY E67B, LB E67C, LV E67C, LT E67C LW T67C LS T679, LY T679, LG T679 LS T770, LO T770, LY T770, LG T770, LP T770 LB T773, LV T773, LT T773, LW T773 LH T774 LS E675, LA E675, LY E675, LS T675 LS T776, LA T776, LO T776, LY T776, LB T776 LHGB T686 LT T68C, LB T68C - Hyper Mini TOPLED® LB M676 - Mini TOPLED Santana® LG M470 LS M47K, LO M47K, LY M47K Source: http://www.osram.convergy.de LUXEON: - LUMILED® LXK2-PW12-R00, LXK2-PW12-S00, LXK2-PW14-U00, LXK2-PW14-V00 LXK2-PM12-R00, LXK2-PM12-S00, LXK2-PM14-U00 LXK2-PE12-Q00, LXK2-PE12-R00, LXK2-PE12-S00, LXK2-PE14-T00, LXK2-PE14-U00 LXK2-PB12-K00, LXK2-PB12-L00, LXK2-PB12-M00, LXK2-PB14-N00, LXK2-PB14-P00, LXK2-PB14-Q00 LXK2-PR12-L00, LXK2-PR12-M00, LXK2-PR14-Q00, LXK2-PR14-R00 LXK2-PD12-Q00, LXK2-PD12-R00, LXK2-PD12-S00 LXK2-PH12-R00, LXK2-PH12-S00 LXK2-PL12-P00, LXK2-PL12-Q00, LXK2-PL12-R00 Source: www.luxeon.com KINGBRIGHT: KA-3528ASYC Source: www.kingbright.com
3.3/2.5/1.1/GND = pinhead:PINHD-1X4: PIN HEADER
74HCT03 = 74xx-eu:74*03: Quad 2-input NAND gate, open collector output
AC97_AUDIO JTAG S.I.O._INTERFACE USB_A_B = con-ml:ML10: HARTING; OC_FARNELL: unknown; OC_NEWARK: unknown
ADC = adc:MCP3021
C1-C19 C21-C27 C42-C51 = rcl:C-EU: CAPACITOR, European symbol
C20 C28 C29 C29A C30 C30A C31-C36 C38-C41 = resistor:C-EU: CAPACITOR, European symbol
D1-D3 = quickswitch:1N4148
GPIO_A P.B.I._INTERFACE = con-ml:ML40E: HARTING; OC_FARNELL: unknown; OC_NEWARK: unknown
GPIO_B = con-ml:ML14: HARTING; OC_FARNELL: unknown; OC_NEWARK: unknown
H1-H7 = holes:MOUNT-PAD-ROUND: MOUNTING PAD, round
HDMI = raspberrypi_cm:HDMI
IC1-IC5 QS3384 = quickswitch:QS3384: IDT Quickswitch - 3.3V/5V conversion
J3 = LIBstereoaudiojack:AUDIO-JACK2: Stereo audio jack with bypass switches. SMT version used on LilyPad MP3 board.
JOY1 JOY2 = con-subd:M09?S: SUB-D; OC_FARNELL: unknown; OC_NEWARK: unknown
JP2 = jumper:JP2E: JUMPER
L1-L3 = rcl:L-EU: INDUCTOR, European symbol
LM339 = SparkFun-AnalogIC:LM339: Based on information from the SLCS006N datasheet from TI (www.ti.com). Change Log Date Author Change July 16, 2008 nick@scantool.net Device created.; DESC: IC, Quad Comparator; MANUF: Texas Instruments; PARTNUM: LM339PWR; SUPPLIER: Digikey:296-6607-1-ND; VALSTAT: PARTNUM
MAX232 = maxim:MAX232ECWE: RS232 TRANSCEIVER; MF: MAXIM; MPN: MAX232ECWE+; OC_FARNELL: 9724435; OC_NEWARK: 67K4440
MIC_IN_SEL = jumper:JP3Q: JUMPER
PF1-PF4 R1-R25 R25A R26-R32 R35-R42 R45 R46 = rcl:R-EU_: RESISTOR, European symbol
R33 R34 R43 R44 R47-R55 = resistor:R-EU_: RESISTOR, European symbol
RESET RESET_LED = jumper:JP1E: JUMPER
RN1-RN37 = resistor-array:742-8: CTS 742 Series 8 Terminations, 4 Resistors
S-VIDEO_COMP = con-yamaichi:MD04SS: YAMAICHI CONNECTOR; OC_FARNELL: unknown; OC_NEWARK: unknown
SD = SD socket:SDSOCKET: Universal SD socket connector. PUSH PUSH type. MPN : a13070300ux0218 UPC : 700955694094
SDRAM = sdram:K4S561632E-TC: SDRAM 4M x 16bit x 4 banks synchronous DRAM. 256 Mbit SDRAM.
SPI = epcs:EPCS: SPI Serial EEPROM; MPN: AT25320B-SSHL-B; OC_FARNELL: 1841578; OC_NEWARK: 12T1359; PACKAGE: SOIC-8; SUPPLIER: Atmel
TR1 = transistor-npn:BC817*: NPN Transistor
TR2 = transistor-pnp:BC857*: PNP Transistror
U$1 = cyclonev_f484:CYCLONEVFPGA484
U$5 = header127:HDR_SMALL_36_DEV_L
U$6 = molex_ps:MOLEX_PS
VGA = SparkFun-Connectors:DB15: DB15 / VGA right angle through-hole female connector.
VIDEODACSA = Analog Devices_By_element14_Batch_1:ADV7125BCPZ170: 8-Bit High Speed Video DAC
X1 X3 = con-usb-3:USB: USB Connectors
X2 = con-subd:F09: SUB-D; OC_FARNELL: unknown; OC_NEWARK: unknown
XTL_50MHZ = crystal:CRYSTAL_RES-: CRYSTAL RESONATOR

## Net classes
3 N$8: width 0.508 mm